# EAGLE design Super_Dolly_Board (EAGLE 6.2)
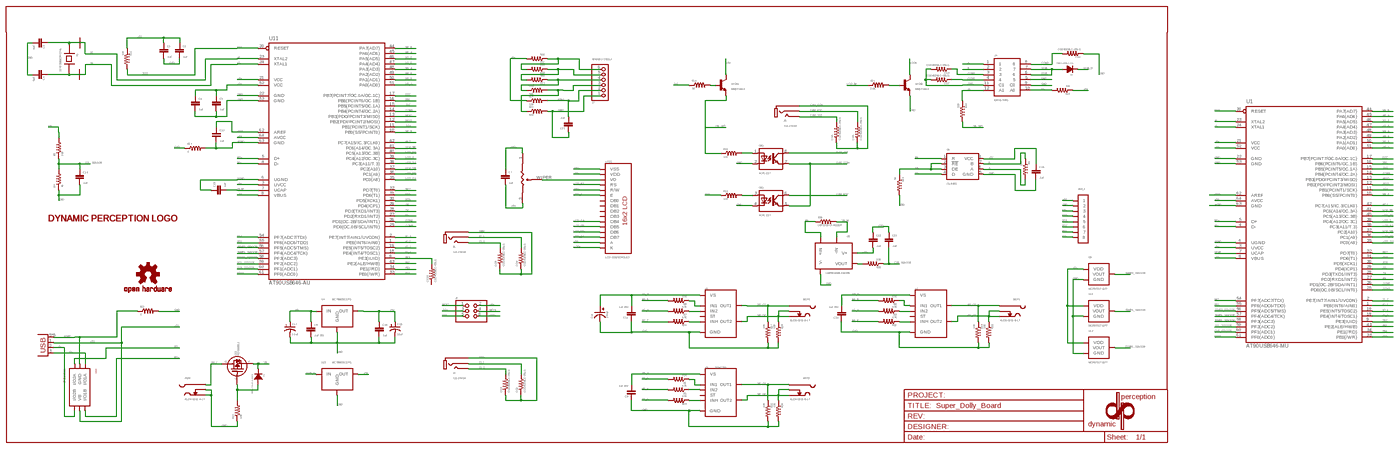
[diagram p0: schematic, sheet 1, overview]
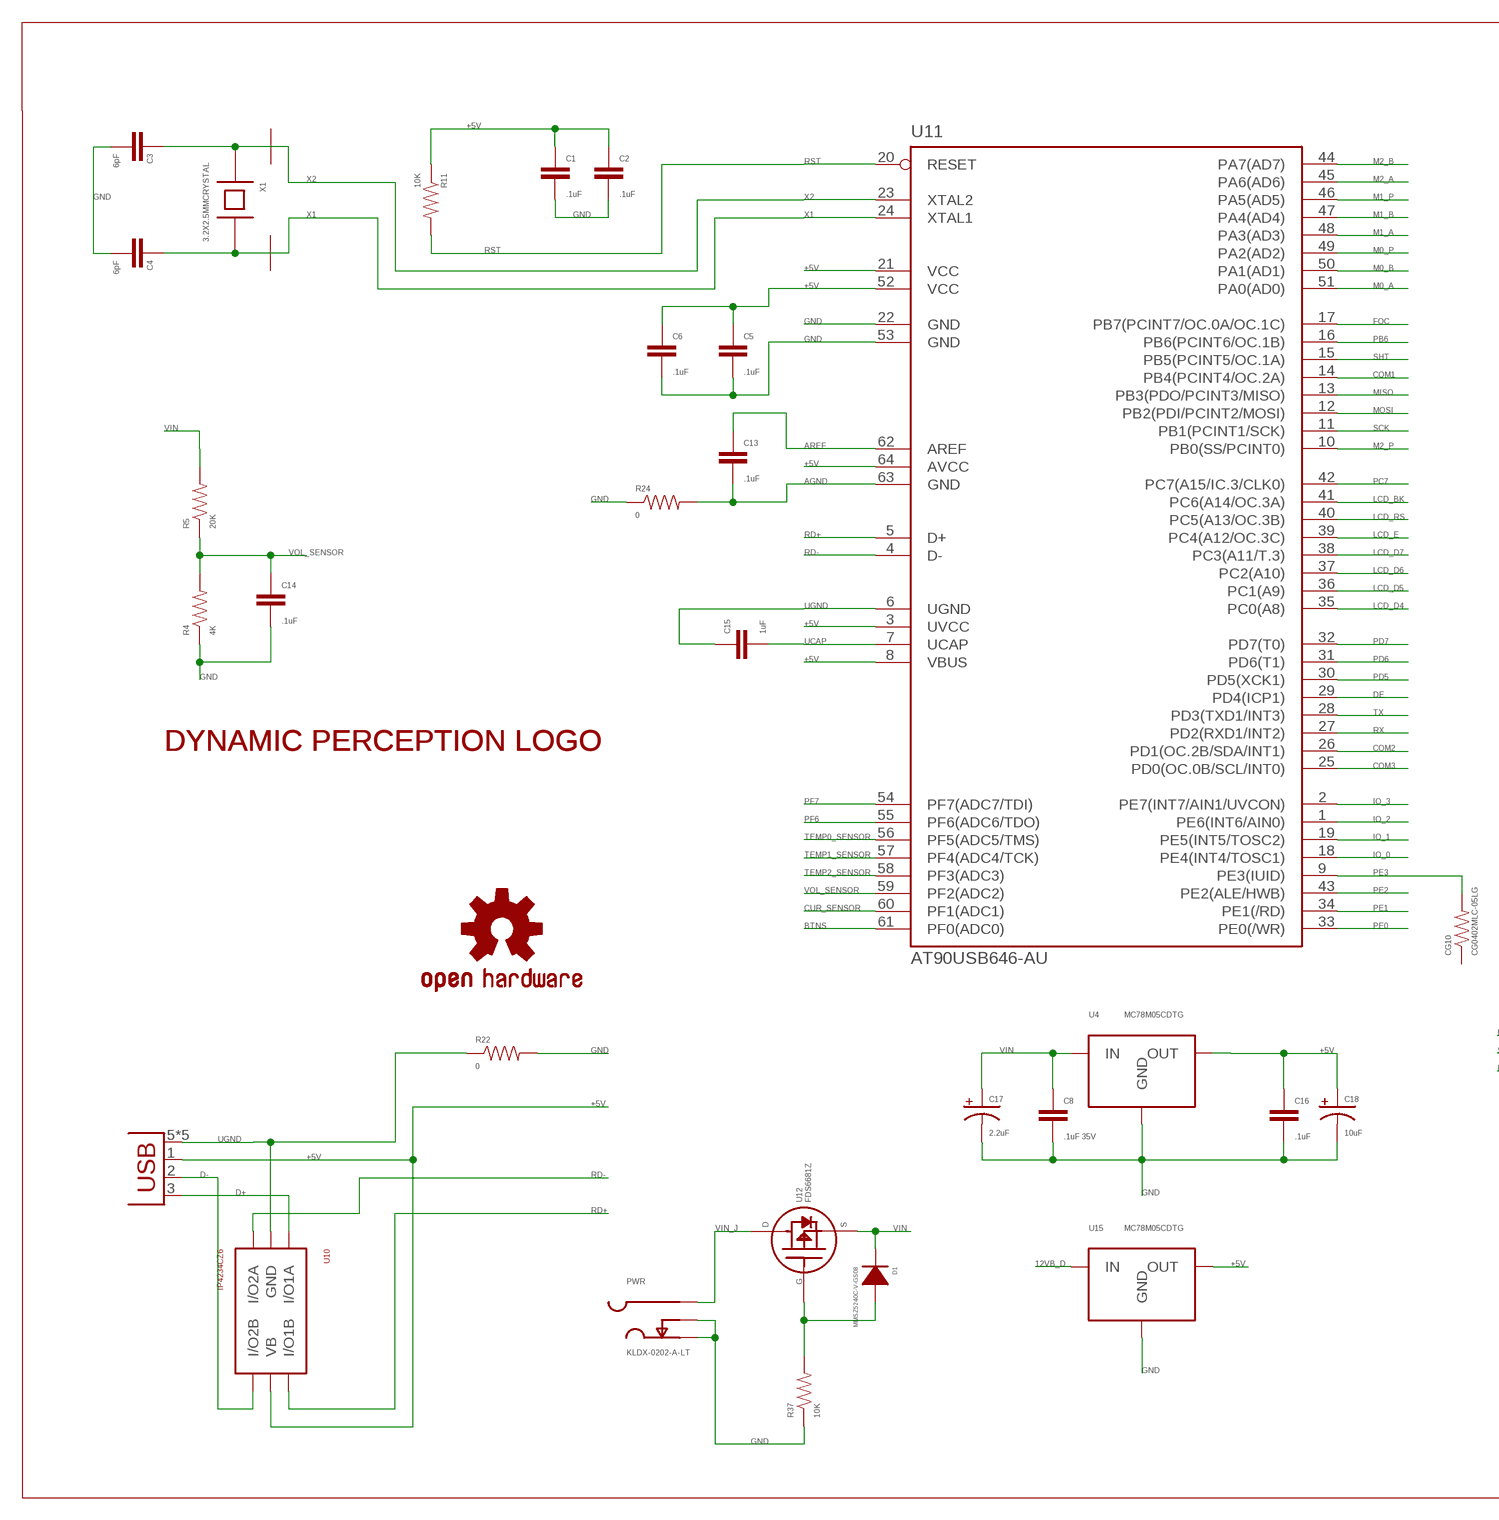
[diagram p1: schematic, sheet 1, part 1 of 4]
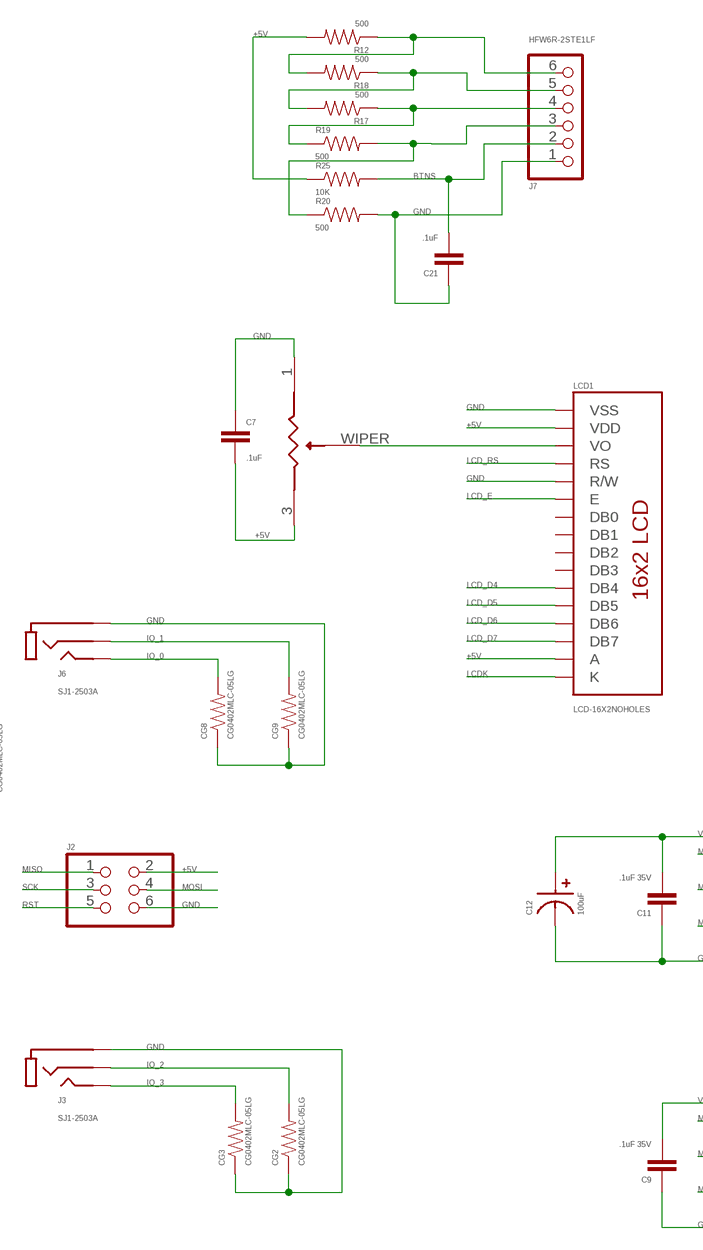
[diagram p2: schematic, sheet 1, part 2 of 4]
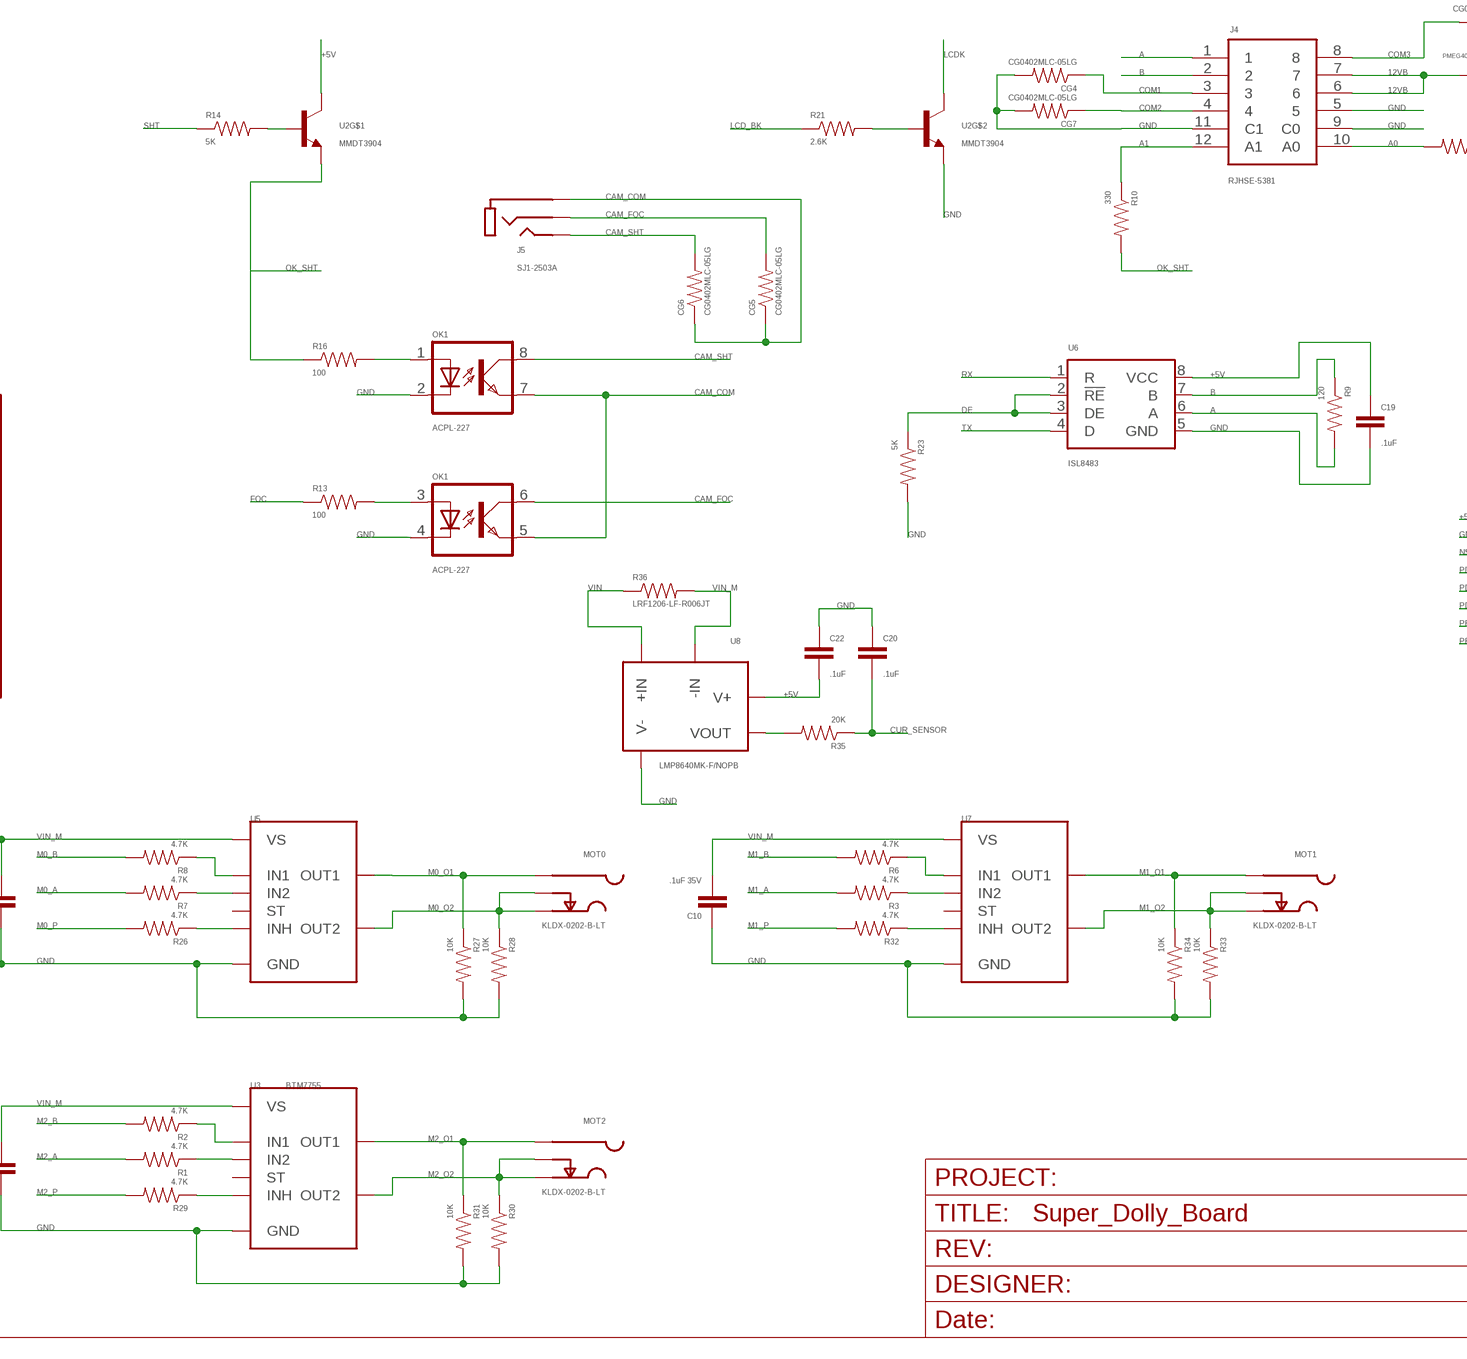
[diagram p3: schematic, sheet 1, part 3 of 4]
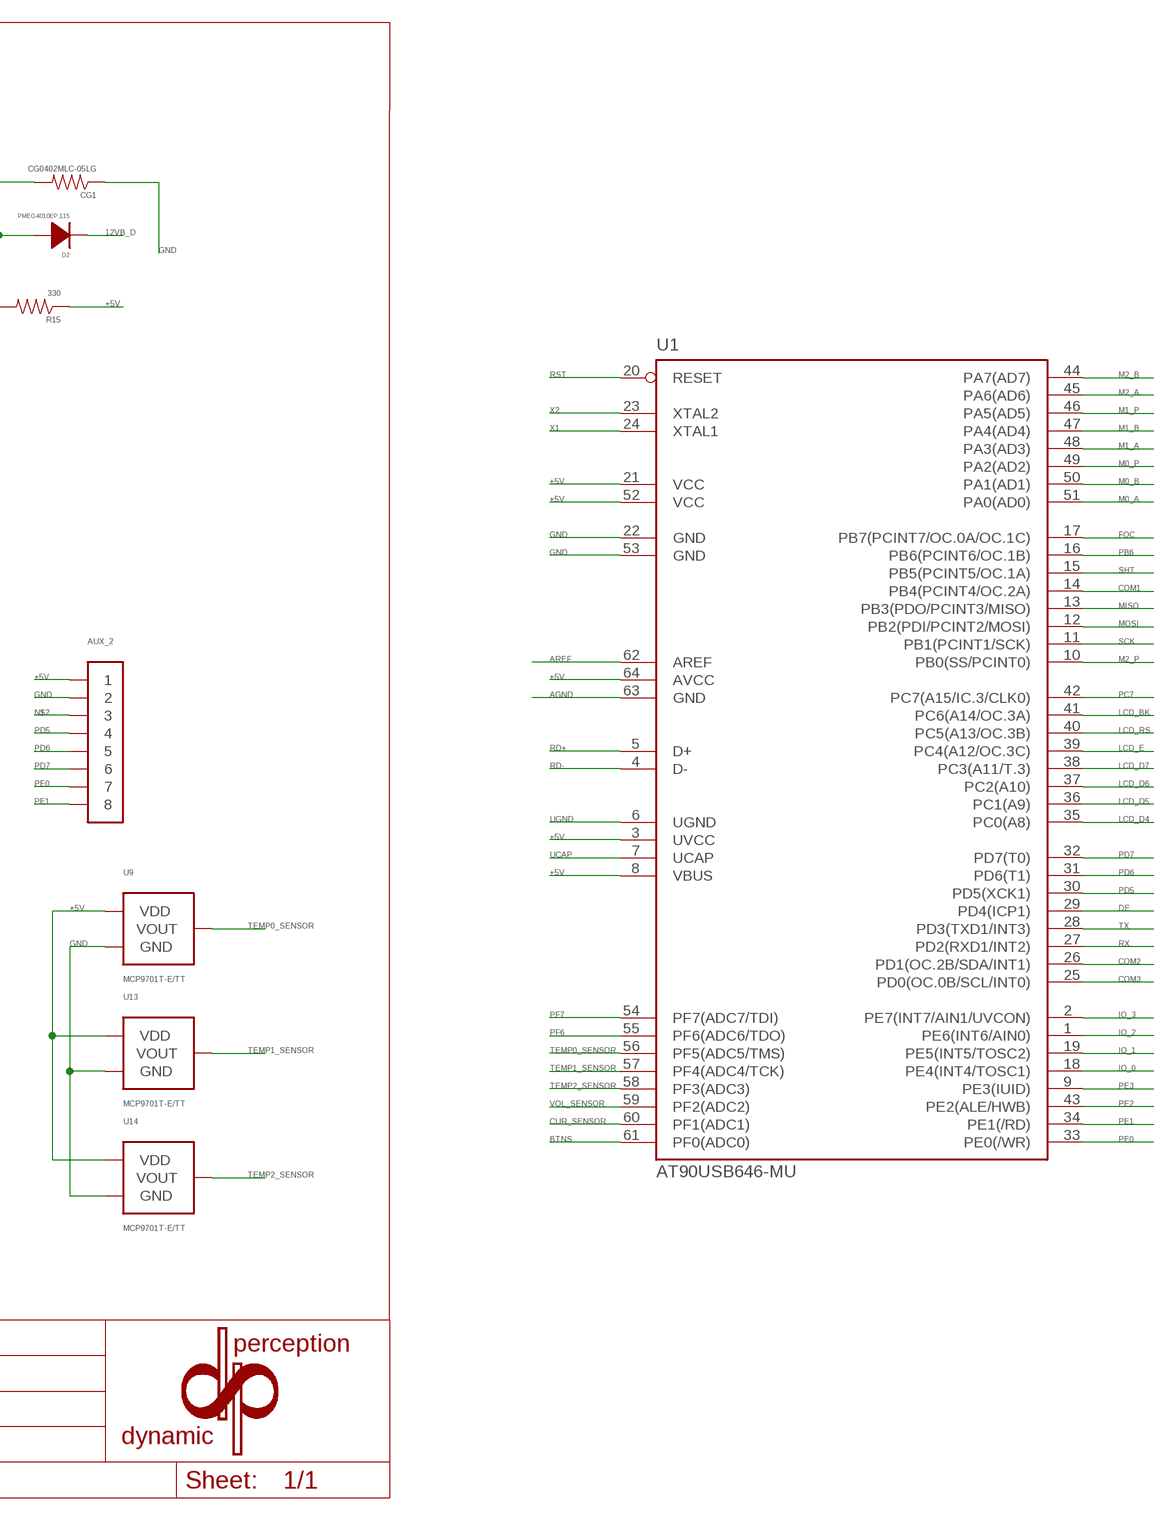
[diagram p4: schematic, sheet 1, part 4 of 4]

## Parts
AUX_2  PH_1X081.27MM_PTH  [HEADER_01X08_1.27_PTH]
C1  .1uF  CAP_NONPOL0402  [0402_CAP]
C2  .1uF  CAP_NONPOL0402  [0402_CAP]
C3  6pF  CAP0402  [C0402]
C4  6pF  CAP0402  [C0402]
C5  .1uF  CAP_NONPOL0402  [0402_CAP]
C6  .1uF  CAP_NONPOL0402  [0402_CAP]
C7  .1uF  CAP_NONPOL0402  [0402_CAP]
C8  .1uF 35V  CAP_NONPOL0402  [0402_CAP]
C9  .1uF 35V  CAP_NONPOL0402  [0402_CAP]
C10  .1uF 35V  CAP_NONPOL0402  [0402_CAP]
C11  .1uF 35V  CAP_NONPOL0402  [0402_CAP]
C12  100uF  CAPACITOR_POLARIZED6.3MM_SMD  [6.3MM_CAP_SMD]
C13  .1uF  CAP_NONPOL0402  [0402_CAP]
C14  .1uF  CAP_NONPOL0402  [0402_CAP]
C15  1uF  CAP_NONPOL0402  [0402_CAP]
C16  .1uF  CAP_NONPOL0402  [0402_CAP]
C17  2.2uF  CAP_POL1206  [EIA3216]
C18  10uF  CAP_POL1206  [EIA3216]
C19  .1uF  CAP_NONPOL0402  [0402_CAP]
C20  .1uF  CAP_NONPOL0402  [0402_CAP]
C21  .1uF  CAP_NONPOL0402  [0402_CAP]
C22  .1uF  CAP_NONPOL0402  [0402_CAP]
CG1  CG0402MLC-05LG  RESISTOR0402  [0402_RES]
CG2  CG0402MLC-05LG  RESISTOR0402  [0402_RES]
CG3  CG0402MLC-05LG  RESISTOR0402  [0402_RES]
CG4  CG0402MLC-05LG  RESISTOR0402  [0402_RES]
CG5  CG0402MLC-05LG  RESISTOR0402  [0402_RES]
CG6  CG0402MLC-05LG  RESISTOR0402  [0402_RES]
CG7  CG0402MLC-05LG  RESISTOR0402  [0402_RES]
CG8  CG0402MLC-05LG  RESISTOR0402  [0402_RES]
CG9  CG0402MLC-05LG  RESISTOR0402  [0402_RES]
CG10  CG0402MLC-05LG  RESISTOR0402  [0402_RES]
D1  MMSZ5240C-V-GS08  DIODESOD-123  [SOD-123]
D2  PMEG4010EP,115  DIODESOD-128  [SOD-128]
J1  10118193-0001LF  USB-PTH-MICROB  [-PTH-MICROB]
J2  P2X03  [P2X03]
J3  SJ1-2503A  TRS_STEREO_JACKSJ1-2503A  [SJ1-2503A]
J4  RJHSE-5381  RJHS-538X  [RIGHT_ANGLE]
J5  SJ1-2503A  TRS_STEREO_JACKSJ1-2503A  [SJ1-2503A]
J6  SJ1-2503A  TRS_STEREO_JACKSJ1-2503A  [SJ1-2503A]
J7  HFW6R-2STE1LF  PH_1X06FFC  [HFW6R-2STE1LF]
LCD1  LCD-16X2NOHOLES  [LCD-16X2_NOHOLES]
LOGO1  DP_LOGOSMALL  [DP_LOGO_SMALL]
LOGO2  DP_LOGOMICRO  [DP_LOGO_MICRO]
LOGO3  DP_LOGOSUPERDOLLYBOARDLOGO  [DP_SDB_LOGO]
MOT0  KLDX-0202-B-LT  DC_JACKPTH_TIGHT  [DC_JACK_PTH_TIGHT]
MOT1  KLDX-0202-B-LT  DC_JACKPTH_TIGHT  [DC_JACK_PTH_TIGHT]
MOT2  KLDX-0202-B-LT  DC_JACKPTH_TIGHT  [DC_JACK_PTH_TIGHT]
OK1  ACPL-227  [SOIC8]
P1  TC33X-2  [3MMSMD]
PWR  KLDX-0202-A-LT  DC_JACKPTH_TIGHT  [DC_JACK_PTH_TIGHT]
R1  4.7K  RESISTOR0402  [0402_RES]
R2  4.7K  RESISTOR0402  [0402_RES]
R3  4.7K  RESISTOR0402  [0402_RES]
R4  4K  RESISTOR0402  [0402_RES]
R5  20K  RESISTOR0402  [0402_RES]
R6  4.7K  RESISTOR0402  [0402_RES]
R7  4.7K  RESISTOR0402  [0402_RES]
R8  4.7K  RESISTOR0402  [0402_RES]
R9  120  RESISTOR0402  [0402_RES]
R10  330  RESISTOR0402  [0402_RES]
R11  10K  RESISTOR0402  [0402_RES]
R12  500  RESISTOR0402  [0402_RES]
R13  100  RESISTOR0402  [0402_RES]
R14  5K  RESISTOR0402  [0402_RES]
R15  330  RESISTOR0402  [0402_RES]
R16  100  RESISTOR0402  [0402_RES]
R17  500  RESISTOR0402  [0402_RES]
R18  500  RESISTOR0402  [0402_RES]
R19  500  RESISTOR0402  [0402_RES]
R20  500  RESISTOR0402  [0402_RES]
R21  2.6K  RESISTOR0402  [0402_RES]
R22  0  RESISTOR0402  [0402_RES]
R23  5K  RESISTOR0402  [0402_RES]
R24  0  RESISTOR0402  [0402_RES]
R25  10K  RESISTOR0402  [0402_RES]
R26  4.7K  RESISTOR0402  [0402_RES]
R27  10K  RESISTOR0805  [0805]
R28  10K  RESISTOR0805  [0805]
R29  4.7K  RESISTOR0402  [0402_RES]
R30  10K  RESISTOR0805  [0805]
R31  10K  RESISTOR0805  [0805]
R32  4.7K  RESISTOR0402  [0402_RES]
R33  10K  RESISTOR0805  [0805]
R34  10K  RESISTOR0805  [0805]
R35  20K  RESISTOR0402  [0402_RES]
R36  LRF1206-LF-R006JT  RESISTOR1206  [1206]
R37  10K  RESISTOR0402  [0402_RES]
U1  AT90USB646-MU  AT90USB647-MU  [MLF64]
U2  MMDT3904  [SOT363]
U3  BTM7755  BTM7755PG-DSO-36-29  [PG-DSO-36-29]
U4  MC78M05CDTG  FIXED_VOLTAGE_REGDPAK-3  [DPAK-3]
U5  BTM7755PG-DSO-36-29  [PG-DSO-36-29]
U6  ISL8483  SN65176D  [SO-08]
U7  BTM7755PG-DSO-36-29  [PG-DSO-36-29]
U8  LMP8640MK-F/NOPB  LMP8640TSOT-6  [TSOT-6]
U9  MCP9701T-E/TT  MCP970XSOT-23-3  [SOT-23-3]
U10  IP4234CZ6  IP4234CZ6SOT-457  [SOT-457]
U11  AT90USB646-AU  AT90USB647-AU  [TQFP64]
U12  FDS6681Z  MOSFET_P-CHANNEL_SINGLEP3-POWER  [DSO-8]
U13  MCP9701T-E/TT  MCP970XSOT-23-3  [SOT-23-3]
U14  MCP9701T-E/TT  MCP970XSOT-23-3  [SOT-23-3]
U15  MC78M05CDTG  FIXED_VOLTAGE_REGDPAK-3  [DPAK-3]
U$1  DP_FRAME  [DP_FRAME]
U$2  OSHW-LOGOS  [OSHW-LOGO-S]
X1  3.2X2.5MMCRYSTAL  [3.2X2.5MM]

## Nets
12VB: D2.ANODE J4.6 J4.7
12VB_D [power]: D2.CATHODE U15.1(IN)
+5V [usbvcc]: AUX_2.P$1 C1.1 C2.1 C5.1 C6.1 C7.2 C16.1 C18.A(+) C19.1 C22.2 J1.1(VBUS) J2.2 LCD1.2(VDD) LCD1.15(A) P1.3 R11.1 R12.2 R15.1 R25.1 U1.3(UVCC) U1.8(VBUS) U1.21(VCC) U1.52(VCC) U1.64(AVCC) U2.3(C) U4.2(OUT) U6.8(VCC) U8.6(V+) U9.1(VDD) U10.5(VB) U11.3(UVCC) U11.8(VBUS) U11.21(VCC) U11.52(VCC) U11.64(AVCC) U13.1(VDD) U14.1(VDD) U15.2(OUT)
A: J4.1 R9.2 U6.6(A)
A0: J4.10(A0) R15.2
A1: J4.12(A1) R10.1
AGND: C13.2 R24.2 U1.63(GND) U11.63(GND)
AREF [aref]: C13.1 U1.62(AREF) U11.62(AREF)
B: J4.2 R9.1 U6.7(B)
BTNS: C21.2 J7.2 R25.2 U1.61(PF0(ADC0)) U11.61(PF0(ADC0))
CAM_COM: CG5.1 CG6.1 J5.1(S) OK1.5(EMIT1) OK1.7(EMIT)
CAM_FOC: CG5.2 J5.4(R) OK1.6(COL1)
CAM_SHT: CG6.2 J5.2(T) J5.3(T) OK1.8(COL)
COM1: CG4.1 J4.3 U1.14(PB4(PCINT4/OC.2A)) U11.14(PB4(PCINT4/OC.2A))
COM2: CG7.1 J4.4 U1.26(PD1(OC.2B/SDA/INT1)) U11.26(PD1(OC.2B/SDA/INT1))
COM3: CG1.2 J4.8 U1.25(PD0(OC.0B/SCL/INT0)) U11.25(PD0(OC.0B/SCL/INT0))
CUR_SENSOR: C20.2 R35.1 U1.60(PF1(ADC1)) U11.60(PF1(ADC1))
D+: J1.3(D+) U10.1(I/O1A)
D-: J1.2(D-) U10.6(I/O2B)
DE: R23.1 U1.29(PD4(ICP1)) U6.2(!RE) U6.3(DE) U11.29(PD4(ICP1))
FOC: R13.1 U1.17(PB7(PCINT7/OC.0A/OC.1C)) U11.17(PB7(PCINT7/OC.0A/OC.1C))
GND: AUX_2.P$2 C1.2 C2.2 C3.1 C4.1 C5.2 C6.2 C7.1 C8.2 C9.1 C10.1 C11.1 C12.NEG C14.2 C16.2 C17.C(-) C18.C(-) C19.2 C20.1 C21.1 C22.1 CG1.1 CG2.1 CG3.1 CG4.2 CG7.2 CG8.1 CG9.1 J2.6 J3.1(S) J4.5 J4.9(C0) J4.11(C1) J6.1(S) J7.1 LCD1.1(VSS) LCD1.5(R/W) OK1.2(C) OK1.4(C1) P1.1 PWR.GND(SLEEVE) PWR.GNDBREAK(SLEEVE_SHUNT) R4.1 R20.2 R22.2 R23.2 R24.1 R27.2 R28.2 R30.2 R31.2 R33.2 R34.2 R37.1 U1.22(GND) U1.53(GND) U2.1(E) U3.5(GND) U3.6(GND) U3.7(GND) U3.8(GND) U3.23(GND) U3.24(GND) U3.25(GND) U3.26(GND) U4.4(GND) U5.5(GND) U5.6(GND) U5.7(GND) U5.8(GND) U5.23(GND) U5.24(GND) U5.25(GND) U5.26(GND) U6.5(GND) U7.5(GND) U7.6(GND) U7.7(GND) U7.8(GND) U7.23(GND) U7.24(GND) U7.25(GND) U7.26(GND) U8.2(V-) U9.3(GND) U11.22(GND) U11.53(GND) U13.3(GND) U14.3(GND) U15.4(GND)
IO_0: CG8.2 J6.2(T) J6.3(T) U1.18(PE4(INT4/TOSC1)) U11.18(PE4(INT4/TOSC1))
IO_1: CG9.2 J6.4(R) U1.19(PE5(INT5/TOSC2)) U11.19(PE5(INT5/TOSC2))
IO_2: CG2.2 J3.4(R) U1.1(PE6(INT6/AIN0)) U11.1(PE6(INT6/AIN0))
IO_3: CG3.2 J3.2(T) J3.3(T) U1.2(PE7(INT7/AIN1/UVCON)) U11.2(PE7(INT7/AIN1/UVCON))
LCD_BK: R21.1 U1.41(PC6(A14/OC.3A)) U11.41(PC6(A14/OC.3A))
LCD_D4: LCD1.11(DB4) U1.35(PC0(A8)) U11.35(PC0(A8))
LCD_D5: LCD1.12(DB5) U1.36(PC1(A9)) U11.36(PC1(A9))
LCD_D6: LCD1.13(DB6) U1.37(PC2(A10)) U11.37(PC2(A10))
LCD_D7: LCD1.14(DB7) U1.38(PC3(A11/T.3)) U11.38(PC3(A11/T.3))
LCD_E: LCD1.6(E) U1.39(PC4(A12/OC.3C)) U11.39(PC4(A12/OC.3C))
LCD_RS: LCD1.4(RS) U1.40(PC5(A13/OC.3B)) U11.40(PC5(A13/OC.3B))
LCDK: LCD1.16(K) U2.6(C)
M0_A: R7.2 U1.51(PA0(AD0)) U11.51(PA0(AD0))
M0_A1: R7.1 U5.10(IN2)
M0_B: R8.2 U1.50(PA1(AD1)) U11.50(PA1(AD1))
M0_B1: R8.1 U5.9(IN1)
M0_O1: MOT0.PWR(PIN) R27.1 U5.1(OUT1) U5.2(OUT1) U5.3(OUT1) U5.4(OUT1) U5.33(OUT1) U5.34(OUT1) U5.35(OUT1) U5.36(OUT1)
M0_O2: MOT0.GND(SLEEVE) MOT0.GNDBREAK(SLEEVE_SHUNT) R28.1 U5.15(OUT2) U5.16(OUT2) U5.17(OUT2) U5.18(OUT2) U5.19(OUT2) U5.20(OUT2) U5.21(OUT2) U5.22(OUT2)
M0_P: R26.2 U1.49(PA2(AD2)) U11.49(PA2(AD2))
M0_P1: R26.1 U5.27(INH)
M1_A: R3.2 U1.48(PA3(AD3)) U11.48(PA3(AD3))
M1_B: R6.2 U1.47(PA4(AD4)) U11.47(PA4(AD4))
M1_O1: MOT1.PWR(PIN) R34.1 U7.1(OUT1) U7.2(OUT1) U7.3(OUT1) U7.4(OUT1) U7.33(OUT1) U7.34(OUT1) U7.35(OUT1) U7.36(OUT1)
M1_O2: MOT1.GND(SLEEVE) MOT1.GNDBREAK(SLEEVE_SHUNT) R33.1 U7.15(OUT2) U7.16(OUT2) U7.17(OUT2) U7.18(OUT2) U7.19(OUT2) U7.20(OUT2) U7.21(OUT2) U7.22(OUT2)
M1_P: R32.2 U1.46(PA5(AD5)) U11.46(PA5(AD5))
M2_A: R1.2 U1.45(PA6(AD6)) U11.45(PA6(AD6))
M2_B: R2.2 U1.44(PA7(AD7)) U11.44(PA7(AD7))
M2_O1: MOT2.PWR(PIN) R31.1 U3.1(OUT1) U3.2(OUT1) U3.3(OUT1) U3.4(OUT1) U3.33(OUT1) U3.34(OUT1) U3.35(OUT1) U3.36(OUT1)
M2_O2: MOT2.GND(SLEEVE) MOT2.GNDBREAK(SLEEVE_SHUNT) R30.1 U3.15(OUT2) U3.16(OUT2) U3.17(OUT2) U3.18(OUT2) U3.19(OUT2) U3.20(OUT2) U3.21(OUT2) U3.22(OUT2)
M2_P: R29.2 U1.10(PB0(SS/PCINT0)) U11.10(PB0(SS/PCINT0))
MISO: J2.1 U1.13(PB3(PDO/PCINT3/MISO)) U11.13(PB3(PDO/PCINT3/MISO))
MOSI: J2.4 U1.12(PB2(PDI/PCINT2/MOSI)) U11.12(PB2(PDI/PCINT2/MOSI))
N$1: R35.2 U8.1(VOUT)
N$2: AUX_2.P$3
N$3: D1.ANODE R37.2 U12.4(GATE)
N$4: R3.1 U7.10(IN2)
N$5: R21.2 U2.2(B)
N$6: R6.1 U7.9(IN1)
N$7: R32.1 U7.27(INH)
N$8: R29.1 U3.27(INH)
N$9: R2.1 U3.9(IN1)
N$10: R1.1 U3.10(IN2)
N$21: LCD1.3(VO) P1.WIPER
N$22: OK1.3(A1) R13.2
N$23: OK1.1(A) R16.2
N$25: R14.2 U2.5(B)
N$27: J7.6 R12.1 R18.2
N$28: J7.4 R17.1 R19.1
N$29: J7.5 R17.2 R18.1
N$30: J7.3 R19.2 R20.1
OK_SHT: R10.2 R16.1 U2.4(E)
PB6: U1.16(PB6(PCINT6/OC.1B)) U11.16(PB6(PCINT6/OC.1B))
PC7: U1.42(PC7(A15/IC.3/CLK0)) U11.42(PC7(A15/IC.3/CLK0))
PD5: AUX_2.P$4 U1.30(PD5(XCK1)) U11.30(PD5(XCK1))
PD6: AUX_2.P$5 U1.31(PD6(T1)) U11.31(PD6(T1))
PD7: AUX_2.P$6 U1.32(PD7(T0)) U11.32(PD7(T0))
PE0: AUX_2.P$7 U1.33(PE0(/WR)) U11.33(PE0(/WR))
PE1: AUX_2.P$8 U1.34(PE1(/RD)) U11.34(PE1(/RD))
PE2: U1.43(PE2(ALE/HWB)) U11.43(PE2(ALE/HWB))
PE3: CG10.2 U1.9(PE3(IUID)) U11.9(PE3(IUID))
PF6: U1.55(PF6(ADC6/TDO)) U11.55(PF6(ADC6/TDO))
PF7: U1.54(PF7(ADC7/TDI)) U11.54(PF7(ADC7/TDI))
RD+: U1.5(D+) U10.3(I/O1B) U11.5(D+)
RD-: U1.4(D-) U10.4(I/O2A) U11.4(D-)
RST: J2.5 R11.2 U1.20(RESET) U11.20(RESET)
RX: U1.27(PD2(RXD1/INT2)) U6.1(R) U11.27(PD2(RXD1/INT2))
SCK: J2.3 U1.11(PB1(PCINT1/SCK)) U11.11(PB1(PCINT1/SCK))
SHT: R14.1 U1.15(PB5(PCINT5/OC.1A)) U11.15(PB5(PCINT5/OC.1A))
TEMP0_SENSOR: U1.56(PF5(ADC5/TMS)) U9.2(VOUT) U11.56(PF5(ADC5/TMS))
TEMP1_SENSOR: U1.57(PF4(ADC4/TCK)) U11.57(PF4(ADC4/TCK)) U13.2(VOUT)
TEMP2_SENSOR: U1.58(PF3(ADC3)) U11.58(PF3(ADC3)) U14.2(VOUT)
TX: U1.28(PD3(TXD1/INT3)) U6.4(D) U11.28(PD3(TXD1/INT3))
UCAP: C15.2 U1.7(UCAP) U11.7(UCAP)
UGND: C15.1 J1.5(GND) J1.S1(GND) J1.S2(GND) J1.S3(GND) J1.S4(GND) R22.1 U1.6(UGND) U10.2(GND) U11.6(UGND)
VIN [power]: C8.1 C17.A(+) D1.CATHODE R5.2 R36.1 U4.1(IN) U8.3(+IN) U12.1(SOURCE) U12.2(SOURCE) U12.3(SOURCE)
VIN_J: PWR.PWR(PIN) U12.5(DRAIN) U12.6(DRAIN) U12.7(DRAIN) U12.8(DRAIN)
VIN_M [power]: C9.2 C10.2 C11.2 C12.POS R36.2 U3.11(VS) U3.12(VS) U3.13(VS) U3.14(VS) U3.29(VS) U3.30(VS) U3.31(VS) U3.32(VS) U5.11(VS) U5.12(VS) U5.13(VS) U5.14(VS) U5.29(VS) U5.30(VS) U5.31(VS) U5.32(VS) U7.11(VS) U7.12(VS) U7.13(VS) U7.14(VS) U7.29(VS) U7.30(VS) U7.31(VS) U7.32(VS) U8.4(-IN)
VOL_SENSOR: C14.1 R4.2 R5.1 U1.59(PF2(ADC2)) U11.59(PF2(ADC2))
X1: C4.2 U1.24(XTAL1) U11.24(XTAL1) X1.3
X2: C3.2 U1.23(XTAL2) U11.23(XTAL2) X1.1
Unconnected: CG10.1 LCD1.7(DB0) LCD1.8(DB1) LCD1.9(DB2) LCD1.10(DB3) U3.28(ST) U5.28(ST) U7.28(ST)

## Power pins joined to a net without a drawn wire
4: X1.4
GND: X1.2(GND)

## Library data of the parts
AUX_2 = PP_Connectors:PH_1X08
C1 C2 C5-C11 C13-C16 C19-C22 = parkers_parts:CAP_NONPOL
C3 C4 = SparkFun:CAP: Capacitor Standard 0603 ceramic capacitor, and 0.1" leaded capacitor.
C12 = PP_Passives:CAPACITOR_POLARIZED: Polarized capacitors
C17 C18 = SparkFun:CAP_POL: Capacitor Polarized These are standard SMD and PTH capacitors. Normally 10uF, 47uF, and 100uF in electrolytic and tantalum varieties. Always verify the external diameter of the through hole cap, it varies with capacity, voltage, and manufacturer. The EIA devices should be standard.
CG1-CG10 R1-R26 R29 R32 R35 R37 = parkers_parts:RESISTOR
D1 D2 = parkers_parts:DIODE
J1 = SparkFun-Connectors:USB: USB Connectors USB-B-PTH is fully proven SKU : PRT-00139 USB-miniB is fully proven SKU : PRT-00587 USB-A-PCB is untested. USB-A-H is throughly reviewed, but untested. Spark Fun Electronics SKU : PRT-00437 USB-B-SMT is throughly reviewed, but untested. Needs silkscreen touching up. USB-A-S has not been used/tested USB-MB-H has not been used/tested
J2 = parkers_parts:P2X03
J3 J5 J6 = parkers_parts:TRS_STEREO_JACK
J4 = amphenol ethernet:RJHS-538X: RJHS-538X series right-angle ethernet (RJ45) connector with two LEDs
J7 = PP_Connectors:PH_1X06: 6 pin connectors
LCD1 = SparkFun-Displays:LCD-16X2: Standard text-only 16x2 parallel input LCD
LOGO1-LOGO3 = parkers_parts:DP_LOGO
MOT0 MOT1 MOT2 PWR = PP_Connectors:DC_JACK: DC JACK
OK1 = avago-opto:ACPL-227: ACPL-227 Dual optocoupler SOIC8
P1 = bourns trimpot:TC33X-2: Bourns TC33X-2 SMD Trimmer Potentiometer
R27 R28 R30 R31 R33 R34 R36 = PP_Passives:RESISTOR: Resistors
U1 U11 = at90usb:AT90USB647-*: Atmel AT90USB647 AVR Microcontroller with USB Interface and 64kB Flash Memory
U2 = SparkFun-DiscreteSemi:MMDT3904: Dual NPN transistor
U3 U5 U7 = PP_PowerIC:BTM7755: Manufacturer Part #: BTM7755 Manufacturer: Infineon Technologies Description: Motor / Motion / Ignition Controllers & Drivers Hi Current H-Bridge Trilith IC 3G
U4 U15 = PP_PowerIC:FIXED_VOLTAGE_REG
U6 = texas:SN65176: DIFFERENTIAL BUS TRANSCEIVER Source: http://focus.ti.com .. sn65176b.pdf; MF: TEXAS INSTRUMENTS; MPN: SN65176BD; OC_FARNELL: 9589970; OC_NEWARK: 08F5891
U8 = PP_AnalogIC:LMP8640
U9 U13 U14 = PP_Sensors:MCP970X
U10 = parkers_parts:IP4234CZ6: Mouser Part #: 771-IP4234CZ6125 Manufacturer Part #: IP4234CZ6,125 Manufacturer: NXP Semiconductors Description: ESD Suppressors Single USB 2.0 ESD Protection 6-Pin http://www.mouser.com/ProductDetail/NXP-Semiconductors/IP4234CZ6125/?qs=sGAEpiMZZMvxHShE6Whpu7QUdHOfUl1T0xbl582qhFk%3d
U12 = PP_DiscreteSemi:MOSFET_P-CHANNEL_SINGLE
U$1 = parkers_parts:DP_FRAME; DNAME: Parker Dillmann; PNAME: MX-2+1; REVNUM: 5
U$2 = SparkFun-Aesthetics:OSHW-LOGO: Open Source Hardware Logo This logo indicates the piece of hardware it is found on incorporates a OSHW license and/or adheres to the definition of open source hardware found here: http://freedomdefined.org/OSHW
X1 = kyocera-crystals:3.2X2.5MMCRYSTAL: Kyocera 3.2x2.5 Mobile Crystal

## Net classes
1 power: width 0.254 mm, drill 0.61 mm, clearance 0.254 mm
2 gnd: width 0.254 mm, drill 0.61 mm, clearance 0.254 mm
3 usbvcc: width 0.254 mm, drill 0.61 mm, clearance 0.254 mm
4 aref: width 0.254 mm, drill 0.61 mm, clearance 0.254 mm

## Board
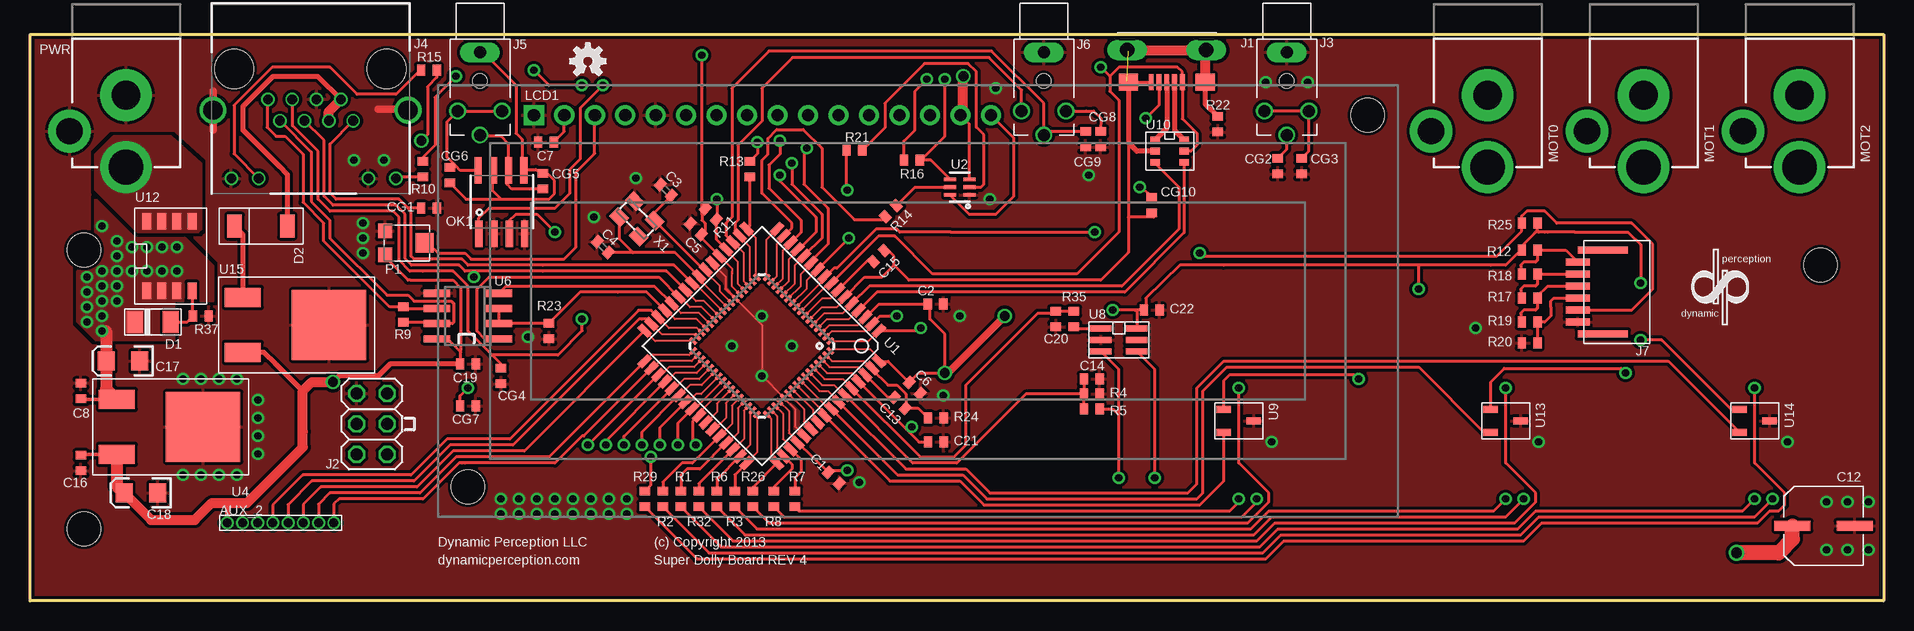
[diagram p5: board, top side]
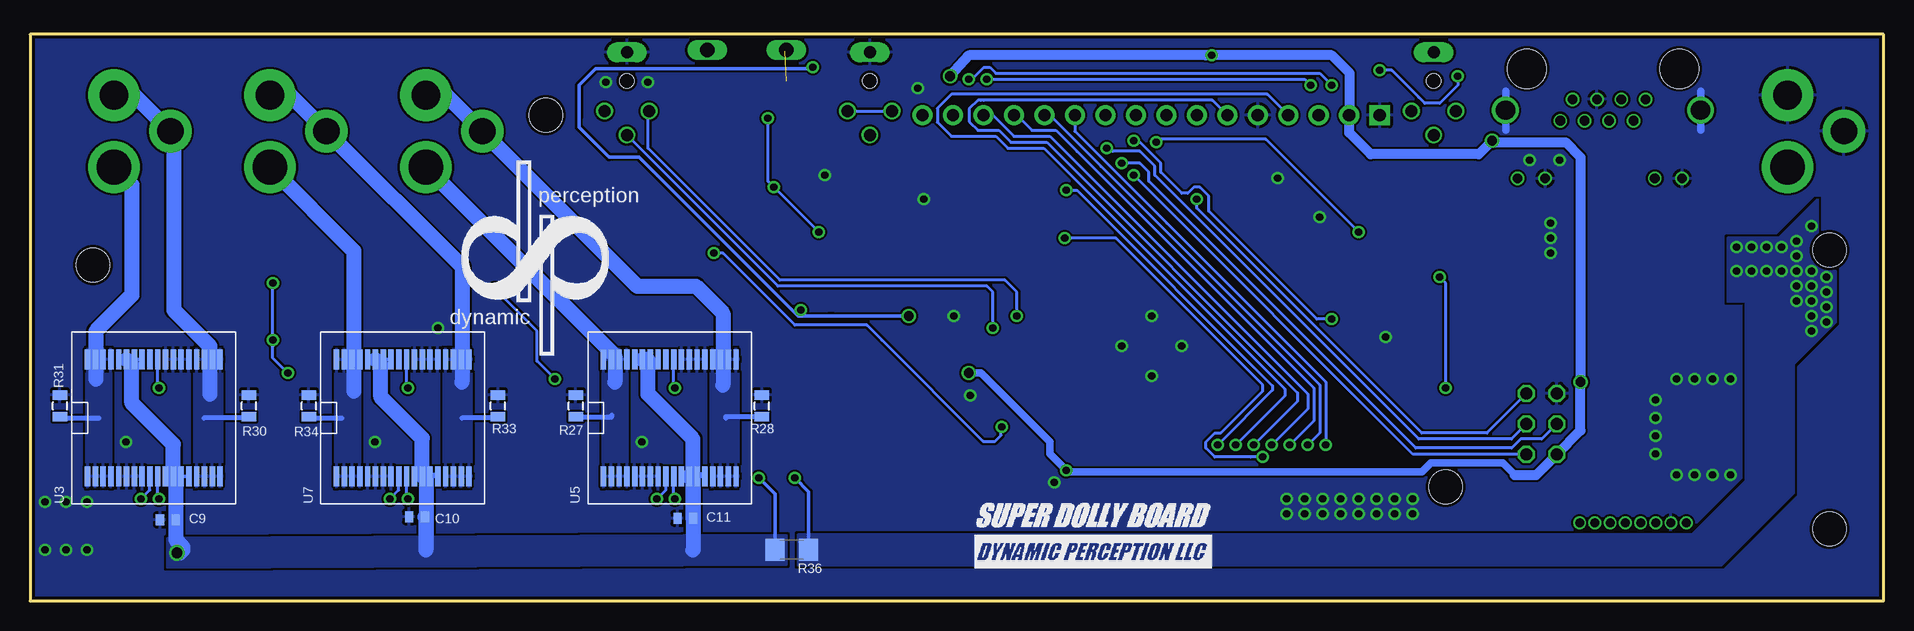
[diagram p6: board, bottom side, seen from below]

Size 154.5 x 47.25 mm. Coordinates in mm from the lower left corner, seen from the top.
Outline: 154.5,47.25 154.5,0 0,0 0,47.25 154.5,47.25
Copper layers (1*16): Top 0.035mm / dielectric 1.5mm / Bottom 0.035mm
Design rules: minimum track width 7mil, minimum drill 8mil, track to track 7mil, track to pad 7mil, pad to pad 7mil, via to via 7mil, smd to smd 7mil, copper to edge 10mil, drill to drill 8mil, minimum pad ring 1mil, minimum via ring 8mil, stop-mask expansion 4mil, vias tented up to drill 25mil, thermal gap 10mil
Holes 2.8 mm at 111.5,40.5 36.5,9.5 4.5,29.25 4.5,6 149.25,28

### Footprints (pad centres in the part's own frame; a part is rotated, then mirrored left to right if it is on the bottom)
HEADER_01X08_1.27_PTH = drill 0.75 pad 1.016: P$1 -3.81,0; P$2 -2.54,0; P$3 -1.27,0; P$4 0,0; P$5 1.27,0; P$6 2.54,0; P$7 3.81,0; P$8 5.08,0
0402_CAP = smd 0.7 x 0.9: 1 -0.65,0; 2 0.65,0
C0402 = smd 0.7 x 0.9: 1 -0.65,0; 2 0.65,0
6.3MM_CAP_SMD = smd 0.8 x 3: NEG 0,-2.6; POS 0,2.6
EIA3216 = smd 1.4 x 1.6: A 1.4,0; C -1.4,0
0402_RES = smd 0.7 x 0.9: 1 -0.65,0; 2 0.65,0
SOD-123 = smd 1.3 x 1.8: ANODE 1.73,0; CATHODE -1.27,0
SOD-128 = smd 1.2 x 1.9: ANODE 2.2,0; CATHODE -2.2,0
-PTH-MICROB = smd 0.4 x 1.35: 1 -1.3,0; 2 -0.65,0; 3 0,0; 4 0.65,0; 5 1.3,0 | drill 1.2 long: S1 -3.3,-2.675; S2 3.3,-2.675 | smd 1.6 x 1.4: S3 -3.2,0; S4 3.2,0
P2X03 = drill 1.016 octagon: 1 -2.54,-1.27; 2 -2.54,1.27; 3 0,-1.27; 4 0,1.27; 5 2.54,-1.27; 6 2.54,1.27
SJ1-2503A = drill 1 pad 1.676 long: 1 0,0 | drill 1: 2 4.9,-1.85; 3 4.9,1.85; 4 6.9,0 | hole 1.2: 2.4,0
RIGHT_ANGLE = drill 0.8: 1 9.906,2.54; 2 8.89,4.32; 3 7.874,2.54; 4 6.858,4.32; 5 5.842,2.54; 6 4.826,4.32; 7 3.81,2.54; 8 2.794,4.32; 9 12.954,9.14; 10 10.668,9.14; 11 1.524,9.14; 12 -0.762,9.14 | drill 1.6: P$1 -1.778,3.43; P$2 14.478,3.43 | hole 3.251: 0,0; 12.7,0
HFW6R-2STE1LF = smd 0.6 x 2: 1 -2.5,0; 2 -1.5,0; 3 -0.5,0; 4 0.5,0; 5 1.5,0; 6 2.5,0 | smd 0.6 x 4.2: PAD0 -3.5,-2.1; PAD1 3.5,-2.1
LCD-16X2_NOHOLES = drill 1.016 pad 1.676 square: 1 -32,15.5 | drill 1.016 pad 1.676: 2 -29.46,15.5; 3 -26.92,15.5; 4 -24.38,15.5; 5 -21.84,15.5; 6 -19.3,15.5; 7 -16.76,15.5; 8 -14.22,15.5; 9 -11.68,15.5; 10 -9.14,15.5; 11 -6.6,15.5; 12 -4.06,15.5; 13 -1.52,15.5; 14 1.02,15.5; 15 3.56,15.5; 16 6.1,15.5
DC_JACK_PTH_TIGHT = drill 2.4 pad 4.318: GND 0,0.08 | drill 2.2 pad 3.556: GNDBREAK 4.7,3.08 | drill 2.9 pad 4.318: PWR 0,6.08
SOIC8 = smd 2.2 x 0.6: 1 0,3.81; 2 0,2.54; 3 0,1.27; 4 0,0; 5 5.28,0.05; 6 5.28,1.32; 7 5.28,2.59; 8 5.28,3.86
3MMSMD = smd 1.2 x 1.2: 1 -0.6,0.6; 3 1.4,0.6 | smd 1.6 x 1.5: WIPER 0.4,3.9
0805 = smd 0.8 x 1.2: 1 -0.9,0; 2 0.9,0
1206 = smd 1.6 x 1.8: 1 -1.4,0; 2 1.4,0
MLF64 = smd 0.7 x 0.3: 1 -4.325,3.75; 2 -4.325,3.25; 3 -4.325,2.75; 4 -4.325,2.25; 5 -4.325,1.75; 6 -4.325,1.25; 7 -4.325,0.75; 8 -4.325,0.25; 9 -4.325,-0.25; 10 -4.325,-0.75; 11 -4.325,-1.25; 12 -4.325,-1.75; 13 -4.325,-2.25; 14 -4.325,-2.75; 15 -4.325,-3.25; 16 -4.325,-3.75; 33 4.325,-3.75; 34 4.325,-3.25; 35 4.325,-2.75; 36 4.325,-2.25; 37 4.325,-1.75; 38 4.325,-1.25; 39 4.325,-0.75; 40 4.325,-0.25; 41 4.325,0.25; 42 4.325,0.75; 43 4.325,1.25; 44 4.325,1.75; 45 4.325,2.25; 46 4.325,2.75; 47 4.325,3.25; 48 4.325,3.75 | smd 0.3 x 0.7: 17 -3.75,-4.325; 18 -3.25,-4.325; 19 -2.75,-4.325; 20 -2.25,-4.325; 21 -1.75,-4.325; 22 -1.25,-4.325; 23 -0.75,-4.325; 24 -0.25,-4.325; 25 0.25,-4.325; 26 0.75,-4.325; 27 1.25,-4.325; 28 1.75,-4.325; 29 2.25,-4.325; 30 2.75,-4.325; 31 3.25,-4.325; 32 3.75,-4.325; 49 3.75,4.325; 50 3.25,4.325; 51 2.75,4.325; 52 2.25,4.325; 53 1.75,4.325; 54 1.25,4.325; 55 0.75,4.325; 56 0.25,4.325; 57 -0.25,4.325; 58 -0.75,4.325; 59 -1.25,4.325; 60 -1.75,4.325; 61 -2.25,4.325; 62 -2.75,4.325; 63 -3.25,4.325; 64 -3.75,4.325
SOT363 = smd 0.3 x 0.99: 1 -0.65,-0.8; 2 0,-0.8; 3 0.65,-0.8; 4 0.65,0.81; 5 0,0.81; 6 -0.65,0.81
PG-DSO-36-29 = smd 1.67 x 0.45: 1 -4.865,5.2; 2 -4.865,4.55; 3 -4.865,3.9; 4 -4.865,3.25; 5 -4.865,2.6; 6 -4.865,1.95; 7 -4.865,1.3; 8 -4.865,0.65; 9 -4.865,0; 10 -4.865,-0.65; 11 -4.865,-1.3; 12 -4.865,-1.95; 13 -4.865,-2.6; 14 -4.865,-3.25; 15 -4.865,-3.9; 16 -4.865,-4.55; 17 -4.865,-5.2; 18 -4.865,-5.85; 19 4.865,-5.85; 20 4.865,-5.2; 21 4.865,-4.55; 22 4.865,-3.9; 23 4.865,-3.25; 24 4.865,-2.6; 25 4.865,-1.95; 26 4.865,-1.3; 27 4.865,-0.65; 28 4.865,0; 29 4.865,0.65; 30 4.865,1.3; 31 4.865,1.95; 32 4.865,2.6; 33 4.865,3.25; 34 4.865,3.9; 35 4.865,4.55; 36 4.865,5.2
DPAK-3 = smd 3 x 1.6: 1 0,-2.285; 2 0,2.285 | smd 6.2 x 5.8: 4 -7.18,0
SO-08 = smd 0.6 x 2.2: 1 -1.905,-2.6; 2 -0.635,-2.6; 3 0.635,-2.6; 4 1.905,-2.6; 5 1.905,2.6; 6 0.635,2.6; 7 -0.635,2.6; 8 -1.905,2.6
TSOT-6 = smd 0.5 x 1.8: 1 -0.95,-1.5; 2 0,-1.5; 3 0.95,-1.5; 4 0.95,1.5; 5 0,1.5; 6 -0.95,1.5
SOT-23-3 = smd 0.6 x 1.2: 1 -0.95,-1.25; 2 0.95,-1.25; 3 0,1.25
SOT-457 = smd 0.8 x 0.55: 1 -1.2,0.95; 2 -1.2,0; 3 -1.2,-0.95; 4 1.2,-0.95; 5 1.2,0; 6 1.2,0.95
TQFP64 = smd 1.194 x 0.559: 1 -7.8,6; 2 -7.8,5.2; 3 -7.8,4.4; 4 -7.8,3.6; 5 -7.8,2.8; 6 -7.8,2; 7 -7.8,1.2; 8 -7.8,0.4; 9 -7.8,-0.4; 10 -7.8,-1.2; 11 -7.8,-2; 12 -7.8,-2.8; 13 -7.8,-3.6; 14 -7.8,-4.4; 15 -7.8,-5.2; 16 -7.8,-6; 33 7.8,-6; 34 7.8,-5.2; 35 7.8,-4.4; 36 7.8,-3.6; 37 7.8,-2.8; 38 7.8,-2; 39 7.8,-1.2; 40 7.8,-0.4; 41 7.8,0.4; 42 7.8,1.2; 43 7.8,2; 44 7.8,2.8; 45 7.8,3.6; 46 7.8,4.4; 47 7.8,5.2; 48 7.8,6 | smd 0.559 x 1.194: 17 -6,-7.8; 18 -5.2,-7.8; 19 -4.4,-7.8; 20 -3.6,-7.8; 21 -2.8,-7.8; 22 -2,-7.8; 23 -1.2,-7.8; 24 -0.4,-7.8; 25 0.4,-7.8; 26 1.2,-7.8; 27 2,-7.8; 28 2.8,-7.8; 29 3.6,-7.8; 30 4.4,-7.8; 31 5.2,-7.8; 32 6,-7.8; 49 6,7.8; 50 5.2,7.8; 51 4.4,7.8; 52 3.6,7.8; 53 2.8,7.8; 54 2,7.8; 55 1.2,7.8; 56 0.4,7.8; 57 -0.4,7.8; 58 -1.2,7.8; 59 -2,7.8; 60 -2.8,7.8; 61 -3.6,7.8; 62 -4.4,7.8; 63 -5.2,7.8; 64 -6,7.8
DSO-8 = smd 0.75 x 1.4: 1 -2.54,-2.9; 2 -1.27,-2.9; 3 0,-2.9; 4 1.27,-2.9; 5 1.27,2.9; 6 0,2.9; 7 -1.27,2.9; 8 -2.54,2.9
3.2X2.5MM = smd 1.3 x 1.05: 1 0.635,0; 2 2.935,0.01; 3 2.935,1.875; 4 0.635,1.865

### Placement (x,y rotation side)
AUX_2  20.25,6.5 0 top
C1  67,10.25 315 top
C2  75.49,24.75 0 top
C3  53,34.25 315 top
C4  47.75,29.5 315 top
C5  55.5,31 135 top
C6  73.75,17.75 315 top
C7  43,38.25 0 top
C8  4.25,17.5 90 top
C9  143,6.75 0 bottom
C10  122.25,7 0 bottom
C11  99.88,6.88 0 bottom
C12  149.5,6.25 90 top
C13  72.5,16.5 315 top
C14  88.5,18.5 0 top
C15  70.75,28.75 225 top
C16  4.25,11.5 270 top
C17  7.75,20 180 top
C18  9.25,9 180 top
C19  36.5,19.75 0 top
C20  85.5,23.5 90 top
C21  75.5,13.25 180 top
C22  93.5,24.25 180 top
CG1  33.25,32.75 180 top
CG2  104,36.25 90 top
CG3  106,36.25 90 top
CG4  39.25,18.75 270 top
CG5  42.75,35 270 top
CG6  35,35.5 90 top
CG7  36.5,16.25 0 top
CG8  89.25,38.5 90 top
CG9  88,38.5 90 top
CG10  93.5,33 90 top
D1  10,23.25 0 top
D2  19.25,31.25 0 top
J1  94.75,43.25 180 top
J2  28.5,14.75 90 top
J3  104.75,45.75 270 top
J4  29.73,44.36 180 top
J5  37.5,45.75 270 top
J6  84.5,45.75 270 top
J7  129,25.75 90 top
LCD1  74,25 0 top
LOGO1  118.5,20.5 0 bottom
LOGO2  138.5,23 0 top
LOGO3  75.75,2.75 0 bottom
MOT0  121.5,42.25 180 top
MOT1  134.5,42.25 180 top
MOT2  147.5,42.25 180 top
OK1  41.22,30.62 90 top
P1  29,30.25 270 top
PWR  8,42.25 180 top
R1  54.25,8.5 90 top
R2  52.75,8.5 90 top
R3  58.75,8.5 90 top
R4  88.5,17.25 180 top
R5  88.5,16 0 top
R6  57.25,8.5 90 top
R7  63.75,8.5 90 top
R8  62,8.5 90 top
R9  31.13,23.87 90 top
R10  32.75,36 90 top
R11  56.75,32.25 315 top
R12  125,29.25 180 top
R13  60,36 90 top
R14  71.75,32.5 45 top
R15  33.25,44.25 180 top
R16  73.5,36.75 180 top
R17  125,25.25 180 top
R18  125,27.25 180 top
R19  125,23.25 0 top
R20  125,21.5 180 top
R21  68.72,37.56 0 top
R22  99,39.75 270 top
R23  43.25,22.5 270 top
R24  75.5,15.25 180 top
R25  125,31.5 180 top
R26  60.25,8.5 90 top
R27  109,16.25 90 bottom
R28  93.5,16.25 90 bottom
R29  51.25,8.5 90 top
R30  136.25,16.25 90 bottom
R31  152,16.25 90 bottom
R32  55.75,8.5 90 top
R33  115.5,16.25 90 bottom
R34  131.25,16.25 90 bottom
R35  87,23.5 270 top
R36  91,4.25 180 bottom
R37  14.25,23.75 180 top
U1  61,21.25 225 top
U2  77.5,34.5 90 top
U3  144.5,15.25 90 bottom
U4  7.25,14.5 180 top
U5  101.5,15.25 90 bottom
U6  36.5,23.75 90 top
U7  123.75,15.25 90 bottom
U8  90.75,21.75 270 top
U9  100.75,15 270 top
U10  95,37.5 0 top
U11  61,21.25 225 top
U12  12.25,28.75 0 top
U13  123,15 270 top
U14  143.75,15 270 top
U15  17.75,23 180 top
U$1  105.25,33.5 0 top
U$2  46.5,45 0 top
X1  52.5,31.25 135 top

### Tracks (layer width: path | path; a pad name or v marks a point on that pad's centre or on a via)
12VB
  Top 0.406: J4.7 23.99,43.75 20.25,43.75 17.75,41.25 17.75,39.25 20.75,36.25 21.45,35.55 D2.ANODE
  Top 0.813: J4.6 24.9,40.8 J4.7
12VB_D
  Top 0.406: D2.CATHODE 17.75,30.55 U15.1
+5V  (via drill 0.6, 0.8)
  Top 0.178: U1.21 58.75,25.98 58.5,26.23 58.5,27.25 | 58.5,27.25 58.5,27.5 | U1.3 66.64,23 69,23 69.63,23.63 U11.3 | U1.64 66.87,21 70,21 70.76,20.24 U11.64 | U11.52 63.97,13.28 63.5,13.75 63.25,14 63.25,14.25 63.25,15.82 U1.52 | U11.21 58.5,27.71 58.5,27.25 | 66.59,26.48 U11.8 66.59,26.48 | U1.8 66.59,26.48
  Top 0.254: U11.21 55.96,30.25 C5.1 56.25,30.54 56.25,31.5 56,31.75 56,32.25 | 69.63,23.63 70.75,24.75 C2.1 75,24.59 75,23.5 76.25,22.25 v76.25,19 74.08,19 C6.1 71.52,19.98 U11.64 | R11.1 56.29,32.54 56,32.25 | U11.52 66.5,10.75 66.54,10.79 66.54,10.87 | 66.54,10.87 C1.1 | C19.1 35.92,19.82 35.92,20.75 | 35.92,20.75 35.92,20.92 35.92,26.1 35.27,26.75 31.7,26.75 31.5,26.75 29.6,28.65 P1.3 | U6.8 34.82,21.84 35.92,20.75 | C7.2 44.54,39.14 LCD1.2 44.54,40.79 | 66.54,10.87 v68.12,10.87 v68.12,10.88 | U2.3 78.3,39.76 LCD1.15 | 56,32.25 v56,45.5 | J1.1 96.05,43.5 | 96.05,43.5 96.05,44.11 95.66,44.5 90.75,44.5 90.12,43.88 90,43.75 | 90,43.75 90,42.5 90.75,41.75 90.75,30.75 87.26,27.26 75.24,27.26 72.09,30.41 70.72,30.41 U11.8 | v89.25,44.5 90,43.75 | J1.1 96.05,43.5 | J1.1 96.05,40.2 97,39.25 97.25,39 97.25,38 96.75,37.5 U10.5 | R15.1 33.9,43.65 33.12,42.88 33.12,38.88 v32.62,38.38 | 125,30.25 125.5,30.75 125.75,30.75 126.25,30.75 126.5,30.75 128.75,30.75 133.19,30.75 134.25,29.69 v134.25,26.5 | 125,30.25 124.35,29.6 | 124.35,29.6 R12.2 | 92.1,24.25 C22.2 93,24.4 93,25.25 95.85,28 99.5,28 115.75,28 | 92.1,24.25 v90.25,24.25 | 92.1,24.25 92.25,24.25 U8.6 | 124.35,29.6 124.35,29.35 123,28 121.75,28 | 121.75,28 115.75,28 | 121.75,28 | U9.1 99.5,18.25 99.5,18.38 100,18.88 110.38,18.88 v110.75,18.5 | v115.75,26 115.75,28 | U13.1 | U13.1 121.75,18.25 122.89,19.39 132.61,19.39 v133,19 | U14.1 141.8,15.95 136,21.75 v134.25,21.75 | 125,30.25 125.65,30.9 R25.1
  Top 0.305: C16.1 4.31,12.21 U4.2
  Top 0.406: AUX_2.P$1 16.5,6.5 16.5,8.16 | U15.2 19.5,20.71 20.47,19.75 22.72,17.5 22.75,17.5 | C19.1 30,19.75 29,18.75 25.75,18.75 v25.25,18.25
  Top 0.61: v76.25,19 76.5,19 v81.25,23.75
  Top 0.813: LCD1.15 77.75,40.69 77.75,43.75 v77.81,43.75 | v25.25,18.25 23.5,18.25 22.75,17.5 22.75,14.1 22.75,12.81 18.09,8.16 16.5,8.16 15.16,8.16 13.75,6.75 10.1,6.75 C18.A
  Top 1.016: U4.2 7.25,9.6 C18.A
  Bottom 0.254: v32.62,38.38 32.5,38.25 32,38.25 | v68.12,10.88 69.5,12.25 | v56,45.5 56.5,45.5 | 108.75,39.5 108.75,43 | v90.25,24.25 90.25,23.75 | v115.75,26 112.25,22.5 112.25,20 v110.75,18.5 | v133,19 134.25,20.25 134.25,21.25 | 134.25,21.25 v134.25,21.75 | v134.25,21.75 v134.25,26.5 | v134.25,21.75 134.25,21.25
  Bottom 0.305: v89.25,44.5 89.55,44.38 107.38,44.38 108.75,43 | 108.75,43 108.75,40.25 108.75,39.5 | 108.62,39.38 106.25,37 103.75,37 90.5,23.75 90.25,23.75 88,23.75 87.5,23.75 v81.25,23.75 | 108.62,39.38 108.75,39.5 | 108.62,39.38 108.75,39.5 | 108.75,39.5 108.75,43
  Bottom 0.61: v76.25,19 75.25,19 69.5,13.25 69.5,12.25 v68.12,10.88 68,10.75 40.75,10.75 38.5,10.75 37.75,11.5 31.75,11.5 30.75,10.5
  Bottom 0.813: v77.81,43.75 76.25,45.5 56.5,45.5 v56,45.5 46,45.5 44.5,44 44.5,40.54 LCD1.2 44.54,39.04 42.75,37.25 33.75,37.25 v32.62,38.38 32.5,38.25 32,38.25 26.5,38.25 25.25,37 v25.25,18.25 25.25,14.19 J2.2 28.94,10.5 30.75,10.5
A
  Top 0.254: J4.1 19.75,41.75 19.75,39.5 20.5,38.75 21.25,38.75 22.75,37.25 22.75,33.25 24.5,31.5 24.5,30 29.98,24.52 R9.2 31.26,24.38 U6.6
A0
  Top 0.254: 32.75,44.5 32.38,44.12 | 32.38,44.12 30.75,42.5 30.5,42.25 27.25,42.25 25,44.5 20.18,44.5 17,41.32 17,37.28 J4.10 | R15.2 32.5,44.25 32.38,44.12
A1
  Top 0.254: 30.52,35.25 J4.12 30.62,35.35 R10.1
AGND
  Top 0.178: U1.63 66.85,20 69.5,20 70.09,19.41 U11.63
  Top 0.254: U11.63 70.19,19.31 71.5,18 72.25,18 73,17.25 73,16.08 | 73,16.08 C13.2 | 73,16.08 74.02,16.08 R24.2
AREF
  Top 0.178: U1.62 66.64,19.5 69,19.5 69.63,18.87 U11.62
  Top 0.254: C13.1 71.51,16.96 U11.62
B
  Top 0.254: J4.2 23.45,37.43 23.45,33.3 25,31.75 25,30.25 29.75,25.5 31.5,25.5 32,25 35.13,25 35.32,24.81 35.32,23.23 35.21,23.12 U6.7 33.8,23.21 R9.1
BTNS  (via drill 0.6)
  Top 0.178: U1.61 66.43,19 68.5,19 69.06,18.44 U11.61
  Top 0.254: U11.61 73.17,14.17 | 73.17,14.17 74.09,13.25 C21.2 | v73.5,14.5 | v73.5,14.5 73.17,14.17 | v97.5,29 97.75,28.75 98,28.75 122.25,28.75 124.35,30.85 R25.2 124.35,32.1 124.5,32.25 124.75,32.5 126.25,32.5 127.25,31.5 133.5,31.5 135.25,29.75 135.25,26 133.5,24.25 J7.2
  Bottom 0.254: v73.5,14.5 73.55,14.45 73.55,13.8 74.05,13.29 75.05,13.29 83.5,21.75 84.75,23 90.75,23 96.75,29 v97.5,29
CAM_COM
  Top 0.254: J5.1 37.75,45.75 40.5,43 40.5,39 41,38.5 41,35.98 | 41,35.98 OK1.5 | OK1.7 38.5,35.77 38.5,34.25 39.25,33.5 | 41,35.98 42.17,35.98 CG5.1 43.1,35.65 43.72,35.03 43.72,33.97 43.25,33.5 39.25,33.5 | CG6.1 36.35,33.5 39.25,33.5
CAM_FOC
  Top 0.254: J5.4 37.6,38.75 39.25,38.75 39.9,38.1 OK1.6 39.75,35.49 39.75,34.75 40.15,34.35 CG5.2
CAM_SHT
  Top 0.254: OK1.8 35.85,35.89 35.5,36.25 | 35.5,36.25 34.75,37 34.75,39.95 J5.2 J5.3 | CG6.2 35.4,36.15 35.5,36.25
COM1  (via drill 0.6)
  Top 0.178: U1.14 62.75,26.89 62.75,29 62.75,29.22 U11.14
  Top 0.254: 38.5,20.5 44,20.5 46.02,22.52 46.02,23.48 v46,23.5 | 38.5,20.5 36.5,22.5 36.5,26.25 35.25,27.5 32.75,27.5 31.65,27.5 30.75,28.4 30.75,32 30.25,32.5 25,32.5 24,33.5 24,37.5 21.88,39.62 21.88,41.8 J4.3 | CG4.1 39.25,19.75 38.5,20.5 | v62.5,38.38 62.5,37.25 61.6,36.35 61.6,34.4 64.25,31.75 64.25,30.72 U11.14
  Bottom 0.254: v46,23.5 47.25,23.5 56.25,32.5 56.25,33.75 57,34.5 57.5,34.5 58,34 58.5,34 60.25,35.75 60.25,36.5 62,38.25 62.12,38.38 v62.5,38.38
COM2  (via drill 0.6)
  Top 0.178: U1.26 56.19,25 55.5,25 54.64,25.86 U11.26
  Top 0.254: U11.26 53.05,27.5 42.75,27.5 37,27.5 | 37,27.5 36.25,27.5 35.75,28 31.81,28 31.25,28.56 31.25,32.25 30.5,33 25.25,33 24.5,33.75 24.5,38.41 J4.4 | CG7.1 35.85,17.1 v36.5,17.75 | v37,27 37,27.5
  Bottom 0.254: v36.5,17.75 36.5,26.5 v37,27
COM3
  Top 0.178: U1.25 55.45,26.45 | 55.45,26.45 55.41,26.48 | U11.25 55.41,26.48 | 55.41,26.48 55.45,26.45
  Top 0.254: U11.25 53.68,28 42.75,28 36.5,28 36,28.5 32.5,28.5 32.25,28.5 32,28.5 31.75,28.75 31.75,32.5 31,33.25 | 31,33.25 30.75,33.5 25.5,33.5 25,34 25,38.1 J4.8 | CG1.2 31.5,32.75 31,33.25
CUR_SENSOR
  Top 0.178: U1.60 66.22,18.5 67.75,18.5 68.5,17.76 U11.60
  Top 0.254: U11.60 74.21,12 77,12 78,13 78,18 84,24 85.35,24 C20.2 R35.1
D+
  Top 0.406: J1.3 94.75,39.4 U10.1
D-
  Top 0.406: J1.2 95.4,39.25 U10.6
DE
  Top 0.178: U1.29 55.57,23.5 53.75,23.5 53.03,24.22 U11.29
  Top 0.254: U6.3 U6.2 39.13,23.15 R23.1 45.85,25.75 49,25.75 51.41,25.75 U11.29
FOC
  Top 0.178: U11.17 59.74,31.01 60.5,30.25 60.5,27.05 U1.17
  Top 0.254: 59.74,31.01 60,31.27 R13.1
GND  (via drill 0.6)
  Top 0.178: 58,26.02 58,27 56.9,28.1 U11.22 | U11.53 63.75,14.54 63.75,16 62.82,16.93 U1.53 61,18.77 61,19.25 61,23.02 U1.22
  Top 0.254: U1.22 58,26.02
  Top 0.61: 15.25,42.5 15.25,39.25 | 29,41 32.25,41
  Bottom 0.61: 15.25,42.5 15.25,39.25 | 31.5,39.25 31.5,42.5
  other vias: 27.75,31.5 27.75,30.25 27.75,29 41.5,22 58.5,21.25 63.5,21.25 61,18.75 61,23.75 80.5,42.75 88.25,35.5 27,36.75 29.5,36.75 39.25,7.25 39.25,8.5 40.75,7.25 40.75,8.5 42.25,7.25 42.25,8.5 43.75,7.25 43.75,8.5 45.25,7.25 45.25,8.5 46.75,7.25 46.75,8.5 48.25,7.25 48.25,8.5 49.75,7.25 49.75,8.5 50.5,35.25 47,32 106.5,43.25 103,43.25 69.12,9.88 76.12,17.12 80,33.5 151.5,4.25 153.25,4.25 149.75,4.25 153.25,8.25 151.5,8.25 149.75,8.25 77.5,23.75 120.5,22.75 103.5,13.25 125.75,13.25 146.5,13.25 19,12.25 19,13.75 19,15.25 19,16.75 12.75,18.5 14.25,18.5 15.75,18.5 17.25,18.5 12.75,10.5 14.25,10.5 15.75,10.5 17.25,10.5
  pour Top (isolate 0.254, rank 6): 0,47.25 0,0 154,0 154,47.25
  pour Bottom (rank 6): 0,47.25 0,0 154,0 154,47.25
IO_0
  Top 0.178: U1.18 60,26.85 60,29.5 59.16,30.34
  Top 0.254: J6.3 88.05,40.85 88.65,40.85 89.25,40.25 CG8.2 | J6.2 82.65,42.6 79.95,45.3 63.55,45.3 61,42.75 61,40 59,38 59,31.75 58.75,31.5 58.75,30.85 U11.18 59.16,30.34
  Bottom 0.254: J6.3 J6.2
IO_1
  Top 0.178: U1.19 59.5,26.64 59.5,29 58.62,29.88
  Top 0.254: CG9.2 84.8,39.15 J6.4 84.5,41.5 80.16,45.84 61.59,45.84 58.5,42.75 58.5,32 58,31.5 58,30.47 U11.19 58.62,29.88
IO_2  (via drill 0.6)
  Top 0.178: U1.1 69.89,21.66 U11.1
  Top 0.254: CG2.2 104.75,37.65 J3.4 | U11.1 74.02,22.52 v74.25,22.75
  Bottom 0.254: J3.4 92.15,26.25 74.75,26.25 74.25,25.75 v74.25,22.75
IO_3  (via drill 0.6)
  Top 0.178: 70.19,22.94 69.75,22.5 66.85,22.5 U1.2
  Top 0.254: J3.2 J3.3 106.6,37.5 CG3.2 | v72.25,23.75 70.85,23.75 U11.2 70.19,22.94
  Bottom 0.254: J3.2 103,40.75 103,37.75 92,26.75 73.25,26.75 72.25,25.75 v72.25,23.75
LCD_BK  (via drill 0.6)
  Top 0.178: U1.41 55.77,15.66 U11.41
  Top 0.254: R21.1 68,37.49 68,34.25 v68.12,34.25 | v55.5,13 55.25,13.25 55.25,15 55.5,15.25 55.5,15.18 U11.41
  Bottom 0.254: v68.12,34.25 67.25,34.25 50.93,17.93 50.93,17.57 v55.5,13
LCD_D4  (via drill 0.6)
  Top 0.178: U1.35 55.36,19.5 53.25,19.5 52.6,18.85 U11.35
  Top 0.254: v46.5,13 46.78,13.25 U11.35
  Bottom 0.254: LCD1.11 67.4,39.15 59.75,31.5 46.5,18.25 v46.5,13
LCD_D5  (via drill 0.6)
  Top 0.178: U1.36 55.57,19 53.75,19 53.03,18.28 U11.36
  Top 0.254: v48,13 48,13.34 U11.36
  Bottom 0.254: LCD1.12 69.5,40.5 65.25,36.25 47,18 47,14 47.5,13.5 v48,13
LCD_D6  (via drill 0.6)
  Top 0.178: U1.37 55.77,18.5 54.5,18.5 53.71,17.71 U11.37
  Top 0.254: v49.5,13 49.5,13.71 U11.37
  Bottom 0.254: LCD1.13 72.25,40.5 71,39.25 69,39.25 67.25,37.5 47.5,17.75 47.5,15 v49.5,13
LCD_D7  (via drill 0.6)
  Top 0.178: U1.38 55.98,18 55,18 54.15,17.15 U11.38
  Top 0.254: v51,13 51,14.08 U11.38
  Bottom 0.254: LCD1.14 74.25,40.5 72.5,38.75 69.5,38.75 48,17.25 48,16 v51,13
LCD_E  (via drill 0.6)
  Top 0.178: U1.39 55.94,17.25 55.5,17.25 54.83,16.58 U11.39
  Top 0.254: v52.5,13 52.5,14.45 U11.39
  Bottom 0.254: LCD1.6 55.95,41.75 75,41.75 75.25,41.75 75.5,41.75 76.22,41.03 76.22,39.97 75.5,39.25 73.75,39.25 72.75,38.25 69.75,38.25 48.85,17.35 48.85,16.65 v52.5,13
LCD_RS  (via drill 0.6)
  Top 0.178: U1.40 55.41,16.02 U11.40
  Top 0.254: v54,13 54,14.82 U11.40
  Bottom 0.254: LCD1.4 51.37,42.25 77.69,42.25 78.86,41.08 78.86,39.92 77.69,38.75 74,38.75 73,37.75 70,37.75 49.91,17.66 49.91,17.09 v54,13
LCDK
  Top 0.254: U2.6 78.29,32.25 80.5,32.25 82,33.75 82,38 82,38.6 LCD1.16
M0_A
  Top 0.178: U1.51 62.75,15.61 62.75,13.5 63.4,12.85 U11.51
  Top 0.254: U11.51 64.25,11.78 64.25,10.75 63.75,10.25 R7.2
M0_A1  (via drill 0.6)
  Top 0.254: R7.1 64.1,7.5 100,7.5 100.75,8.25 v100.75,8.5
  Bottom 0.254: v100.75,8.5 100.85,8.6 U5.10
M0_B
  Top 0.178: U1.50 62.25,15.4 62.25,12.75 62.84,12.16 U11.50
  Top 0.254: U11.50 63.5,11.4 63.5,11 62,9.5 R8.2
M0_B1  (via drill 0.6)
  Top 0.254: R8.1 62.85,7 101,7 102.25,8.25 v102.25,8.5
  Bottom 0.254: v102.25,8.5 101.5,9.25 U5.9
M0_O1
  Bottom 0.406: R27.1 106,15.35 106,15.5
  Bottom 1.27: MOT0.PWR 105.75,20.42 105.75,18.25
  pour Bottom (isolate 0.254): 104.75,21 104.75,9.5 106.75,9.5 106.75,21
M0_O2
  Bottom 0.406: R28.1 96.5,15.35 96.5,15.25
  Bottom 1.27: MOT0.GNDBREAK 116.44,38.81 | 116.44,38.81 103.88,26.25 99,26.25 96.75,24 96.75,18 | MOT0.GND 119.8,42.17 116.44,38.81
  pour Bottom (isolate 0.203): 95.5,21 95.5,9.5 97.75,9.5 97.75,21
M0_P
  Top 0.178: U1.49 61.75,15.2 61.75,12 62.26,11.49
  Top 0.254: R26.2 60.25,9.47 U11.49 62.26,11.49
M0_P1  (via drill 0.6)
  Top 0.254: R26.1 61.6,6.5 101.25,6.5 101.5,6.5 103.25,8.25 103.25,9 100.75,11.5 v100.75,17.75
  Bottom 0.254: v100.75,17.75 100.85,18.1 U5.27
M1_A
  Top 0.178: U1.48 60.59,12.36 U11.48
  Top 0.254: U11.48 58.75,10.52 R3.2
M1_B
  Top 0.178: 59.16,12.16 60,13 60,15.65 U1.47
  Top 0.254: R6.2 57.25,10.15 U11.47 59.16,12.16
M1_O1
  Bottom 0.406: R34.1 131.15,15.25 128.5,15.25
  Bottom 1.27: MOT1.PWR 127.5,29.17 127.5,17.5
  pour Bottom (isolate 0.254): 127,21 127,9.5 129,9.5 129,21
M1_O2
  Bottom 0.406: R33.1 115.6,15.25 118.5,15.25
  Bottom 1.27: 118.5,18.25 118.5,27.87 MOT1.GNDBREAK 132.8,42.17 MOT1.GND
  pour Bottom (isolate 0.203): 117.75,21 117.75,9.5 120,9.5 120,21
M1_P
  Top 0.178: U1.46 59.5,15.86 59.5,13.5 58.62,12.62 | 58.62,12.62 U11.46 58.62,12.62
  Top 0.254: U11.46 55.75,9.78 R32.2
M2_A
  Top 0.178: 58.19,13.19 59,14 59,16.07 U1.45
  Top 0.254: R1.2 54.25,10.5 54.75,11 55.84,11 U11.45 58.19,13.19
M2_B
  Top 0.178: 57.5,13.76 58.5,14.75 58.5,16.27 U1.44
  Top 0.254: R2.2 52.75,9.9 54.35,11.5 55.21,11.5 U11.44 57.5,13.76
M2_O1
  Bottom 0.406: R31.1 151.9,15.25 148.75,15.25
  Bottom 1.27: MOT2.PWR 146,34.67 146,25.5 149,22.5 149,18.5
  pour Bottom (isolate 0.254): 147.75,21 147.75,9.5 149.75,9.5 149.75,21
M2_O2
  Bottom 0.406: R30.1 136.35,15.25 140,15.25
  Bottom 1.27: 139.5,17.25 139.5,21.25 142.5,24.25 142.5,38.87 MOT2.GNDBREAK 145.8,42.17 MOT2.GND
  pour Bottom (isolate 0.203): 138.5,21 138.5,9.5 140.75,9.5 140.75,21
M2_P  (via drill 0.6)
  Top 0.178: U1.10 64.75,26.06 64.75,26.75 65.61,27.61
  Top 0.254: R29.2 51.75,9.65 v51.75,12 | v68.25,30.25 65.67,27.67 U11.10 65.61,27.61
  Bottom 0.254: v51.75,12 52.75,12 55.75,12 56.5,12.75 56.5,13.25 55.75,14 55.5,14 55.25,14 51.75,17.5 51.75,18 64,30.25 v68.25,30.25
MISO  (via drill 0.6)
  Top 0.178: U1.13 63.25,26.68 63.25,28.5 63.97,29.22 U11.13
  Top 0.254: v62.5,35.5 62.5,35 65.5,32 65.5,30.75 64.06,29.31 U11.13
  Bottom 0.254: J2.1 39.21,12.21 v62.5,35.5
MOSI  (via drill 0.6)
  Top 0.178: U1.12 63.75,26.48 63.75,28 64.5,28.75 U11.12
  Top 0.254: v63.5,36.5 63.5,34.75 66,32.25 66,30.25 64.54,28.79 U11.12
  Bottom 0.254: J2.4 28.48,13.5 30.25,13.5 31,12.75 39,12.75 61.25,35 61.25,35.75 62,36.5 v63.5,36.5
N$1
  Top 0.254: R35.2 87.15,22.7 U8.1
N$3
  Top 0.254: U12.4 13.52,23.83 R37.2 13.1,23.25 D1.ANODE
N$4  (via drill 0.6)
  Top 0.254: R3.1 60.6,6 101.75,6 103.25,7.5 122,7.5 v123,8.5 | v123,8.5
  Bottom 0.254: v123,8.5 123.1,8.6 U7.10
N$5
  Top 0.254: U2.2 79.25,34.5 79.5,34.75 79.5,38.88 78.88,39.5 78.88,44.13 78.2,44.8 74.56,44.8 71.25,41.5 71.25,39.45 R21.2
N$6  (via drill 0.6)
  Top 0.254: R6.1 59.6,5.5 102,5.5 103.5,7 123,7 v124.5,8.5
  Bottom 0.254: v124.5,8.5 123.75,9.25 U7.9
N$7  (via drill 0.6)
  Top 0.254: R32.1 58.6,5 102.25,5 103.75,6.5 123.5,6.5 123.75,6.5 125.5,8.25 125.5,9 123,11.5 v123,17.75
  Bottom 0.254: v123,17.75 123.1,17.85 U7.27
N$8  (via drill 0.6)
  Top 0.254: R29.1 55.6,3.5 103,3.5 104.5,5 124.5,5 126,6.5 144,6.5 145,7.5 145.75,7.5 146.25,8 146.25,9 143.75,11.5 v143.75,17.75
  Bottom 0.254: v143.75,17.75 143.85,18.1 U3.27
N$9  (via drill 0.6)
  Top 0.254: R2.1 56.6,4 102.75,4 104.25,5.5 124.25,5.5 125.75,7 143.75,7 v145.25,8.5
  Bottom 0.254: v145.25,8.5 144.5,9.25 U3.9
N$10  (via drill 0.6)
  Top 0.254: R1.1 57.6,4.5 102.5,4.5 104,6 124,6 125.5,7.5 127.25,7.5 142.75,7.5 v143.75,8.5
  Bottom 0.254: v143.75,8.5 143.85,8.6 U3.10
N$12  (via drill 0.6)
  Top 0.254: v93,40.25 94.12,41.38 94.12,43.25
  Bottom 0.254: 93,35 v93,40.25
N$21
  Top 0.254: LCD1.3 47.08,37.33 47,37.25 45.5,35.75 45.5,29.5 44.5,28.5 36.75,28.5 36.25,29 34,29 33.15,29.85 P1.WIPER
N$22  (via drill 0.6)
  Top 0.254: OK1.3 39.95,31.7 40.5,32.25 42.25,32.25 v43.75,30.75 | v60.62,38.25 60.62,37.27 R13.2
  Bottom 0.254: v43.75,30.75 51.5,38.5 60.25,38.5 60.5,38.25 v60.62,38.25
N$23  (via drill 0.6)
  Top 0.254: OK1.1 37.41,31.91 38.25,32.75 43.75,32.75 45,34 45,36 45.75,36.75 45.88,36.88 45.88,41.12 46.75,42 v47.75,43 | R16.2 72.85,38.35 73.75,39.25 73.75,42.5 v74.75,43.5
  Bottom 0.254: v74.75,43.5 48.25,43.5 v47.75,43
N$25
  Top 0.254: R14.2 73.75,34.5 U2.5
N$27
  Top 0.254: J7.6 128,29.25 R12.1 125.65,28.4 125.5,28.25 124.5,28.25 124.25,28 124.25,27.35 R18.2
N$28
  Top 0.254: J7.4 126.5,26.25 125.65,25.4 R17.1 125.65,24.4 125.5,24.25 124.5,24.25 124.25,24 124.25,23.35 R19.1
N$29
  Top 0.254: J7.5 R18.1 125.65,26.4 125.5,26.25 124.5,26.25 124.25,26 124.25,25.35 R17.2
N$30
  Top 0.254: R19.2 125.65,23.4 | J7.3 127,25.25 126.75,25 126.75,24.5 126.75,23.75 126.25,23.25 R19.2 | R19.2 R20.1
OK_SHT  (via drill 0.6)
  Top 0.254: U2.4 75.09,36.75 R16.1 74.25,36.75 76.25,38.75 v76.25,43.5 | v46,43 43.25,43 v42,44.25 | v35.5,43.75 33.75,42 33.75,38 32.75,37 R10.2
  Bottom 0.254: v76.25,43.5 76,43.5 75.25,44.25 75,44.5 74.5,44.5 74,44 47,44 v46,43 | v35.5,43.75 35.5,43 36.5,42 37,41.5 38.25,41.5 38.75,42 41,44.25 v42,44.25
PB6
  Top 0.178: U1.16 61.41,30.14 U11.16
PC7
  Top 0.178: U1.42 57.25,16.44 57.25,15.75 56.39,14.89 U11.42
PD5
  Top 0.178: U1.30 55.61,22.75 53.25,22.75 52.37,23.63 U11.30
  Top 0.254: 52.37,23.63 51.78,24.22 50.72,24.22 40,13.5 34.75,13.5 31.75,10.5 22.75,10.5 20.25,8 AUX_2.P$4
PD6
  Top 0.178: U11.31 52.65,22.25 55,22.25 55.4,22.25 U1.31
  Top 0.254: U11.31 51.4,23.5 51,23.5 50.75,23.5 40.25,13 35,13 32,10 23.5,10 21.52,8.02 AUX_2.P$5
PD7
  Top 0.178: U1.32 52.11,21.66 U11.32
  Top 0.254: U11.32 41.22,12.5 35.25,12.5 32.25,9.5 24.25,9.5 22.79,8.04 AUX_2.P$6
PE0
  Top 0.178: U1.33 54.95,20.5 51.75,20.5 51.24,19.99 U11.33
  Top 0.254: U11.33 43.27,12 35.5,12 32.5,9 25,9 24.06,8.06 AUX_2.P$7
PE1
  Top 0.178: U1.34 55.15,20 52.5,20 51.91,19.41 U11.34
  Top 0.254: U11.34 46.15,13.75 46,13.75 43.75,11.5 36.25,11.5 36,11.5 35.75,11.5 33.5,9.25 32.75,8.5 25.75,8.5 25.33,8.08 AUX_2.P$8
PE2
  Top 0.178: U1.43 58,16.48 58,15.25 57.07,14.32 U11.43
PE3  (via drill 0.6)
  Top 0.178: U1.9 66.23,26.84 U11.9
  Top 0.254: 66.12,26.88 67,27.75 67.25,27.75 70.5,31 72.25,31 72.5,30.75 76.75,30.75 85,30.75 v88.75,30.75 | 66.12,26.88 66,26.75 | 66.23,26.84 66.12,26.84 66.12,26.88 | CG10.2 92.65,34.5 v92.5,34.5
  Bottom 0.254: v88.75,30.75 v92.5,34.5 | v92.5,34.5 92.88,34.88 | 92.88,34.88 93,35 | v92.5,34.5 92.88,34.88
PF6
  Top 0.178: U1.55 65.25,15.94 65.25,15.5 65.67,15.08 U11.55
PF7
  Top 0.178: U1.54 63.19,17.31 64.5,16 64.5,14.92 U11.54
RD+
  Top 0.178: U1.5 66.22,24 67.75,24 68.5,24.75 U11.5
  Top 0.254: U10.3 93.8,36.45 95.75,34.5 95.75,31 91,26.25 69.96,26.25 U11.5
RD-
  Top 0.178: U1.4 66.43,23.5 68.25,23.5 68.97,24.22 U11.4
  Top 0.254: U11.4 70.59,25.75 91.25,25.75 96.2,30.7 U10.4
RST  (via drill 0.6)
  Top 0.178: U1.20 59,26.43 59,28.25 58.03,29.22 U11.20
  Top 0.254: U11.20 57.21,30.13 R11.2 57.25,31.83 v57.25,33.5
  Bottom 0.254: J2.5 33.06,14 38.5,14 57.25,32.75 v57.25,33.5
RX
  Top 0.178: U1.27 55.98,24.5 55,24.5 54.15,25.35 U11.27
  Top 0.254: U6.1 37.91,21.84 37.25,22.5 37.25,26 38.25,27 52.42,27 U11.27
SCK  (via drill 0.6)
  Top 0.178: U1.11 64.25,26.27 64.25,27.25 65.1,28.1 U11.11
  Top 0.254: v64.75,37.75 64.5,37.5 64.5,34.75 66.5,32.75 66.5,29.75 65.1,28.35 U11.11
  Bottom 0.254: J2.3 31.02,13.5 38.75,13.5 60.75,35.5 60.75,36.25 62,37.5 64.25,37.5 64.5,37.5 v64.75,37.75
SHT
  Top 0.178: 62.84,30.34 62.25,29.75 62.25,27.1 U1.15
  Top 0.254: 71.29,31.79 R14.1 71.03,31.78 68.72,31.78 66,34.5 66,37.75 64.45,39.3 62.24,39.3 61.5,38.56 61.5,37.25 61,36.75 61,34 63.5,31.5 63.5,31.1 U11.15 62.84,30.34
TEMP0_SENSOR
  Top 0.178: U1.56 66.23,15.66 U11.56
  Top 0.254: U11.56 71.68,10 77.5,10 79.5,8 97.5,8 99.5,10 U9.2
TEMP1_SENSOR
  Top 0.178: U1.57 66.59,16.02 U11.57
  Top 0.254: U11.57 72.32,10.5 77.5,10.5 77.75,10.5 79.75,8.5 97.25,8.5 97.75,9 97.75,17.5 99.75,19.5 115.75,19.5 121.2,14.05 U13.2
TEMP2_SENSOR
  Top 0.178: U1.58 65.81,17.5 66.5,17.5 67.36,16.64 U11.58
  Top 0.254: 67.36,16.64 73,11 77.5,11 78,11 80,9 96.5,9 97.25,9.75 97.25,17.75 99.5,20 116,20 135.5,20 136.55,20 U14.2
TX
  Top 0.178: U1.28 55.77,24 54.25,24 53.5,24.75 U11.28
  Top 0.254: U6.4 39.7,26.25 51.75,26.25 52.04,26.25 U11.28
UCAP
  Top 0.178: U1.7 66.06,25.25 66.75,25.25 67.36,25.86 U11.7
  Top 0.254: U11.7 69.99,28.54 C15.2
UGND  (1 unrouted)
  Top 0.178: U1.6 66.02,24.5 67.25,24.5 67.93,25.18 U11.6
  Top 0.254: U11.6 69.58,27 71,27 72,28 | 72,28 72,28.75 71.29,29.46 C15.1 | J1.S3 97.95,45.95 98,46 | J1.5 J1.S4 91.45,43.35 | 91.55,38.2 91.55,32 | 91.55,32 91.55,29.05 89.25,26.75 73.25,26.75 72,28 | 93.65,32 91.55,32
  Top 0.406: 98.1,43.4 J1.S3 97.95,41.45 R22.1 | J1.S4 91.55,38.2 91.75,38 92.25,37.5 U10.2
  Top 0.813: J1.S3 97.95,45.83 J1.S1 J1.S2 91.55,45.83
VIN  (via drill 0.6)
  Top 0.254: v90.75,10.25 90.75,15.5 | 90.75,15.5 90.75,16 90.75,19.3 U8.3 | R5.2 90.25,16 90.75,15.5
  Top 0.305: C8.1 4.31,16.79 U4.1
  Top 1.016: v6,22.5 6.35,22.5 C17.A 6.35,17.69 U4.1
  Bottom 0.305: v90.75,10.25 89.6,9.1 R36.1
  Bottom 0.406: R36.1 90.25,4.9
  other vias: 9.75,29.5 11,29.5 12.25,29.5 9.75,27.5 11,27.5 12.25,27.5 8.5,29.5 8.5,27.5 7.25,27.5 6,27.5 6,26.25 6,25 6,23.75 7.25,26.25 7.25,25 7.25,28.75 7.25,30 6,31.25 4.75,27 4.75,25.75 4.75,24.5 4.75,23.25
  pour Bottom (no thermals): 90.5,5.5 90.5,3 13.5,3 7.5,9 7.5,19.75 4,23.25 4,27.5 5.5,29.5 5.5,33.5 8.75,30.25 13,30.25 13,25 11.5,25 11.5,10 16,5.5
  pour Top (no thermals): 15.25,25 12,25 12,21.75 5.5,21.75 5.5,21.75 4,23.25 4,27.5 5.5,29 5.5,33.5 8.75,30.25 12.95,30.25 15.25,27.95
VIN_J
  pour Top (no thermals): 14,30.75 9,30.75 5.5,34.25 5.5,37.25 7,38.75 11.75,38.75 14.25,36.5 14.25,31
VIN_M  (via drill 0.6, 0.9)
  Top 0.254: v93.75,10.25 93.75,19.3 U8.4
  Top 1.27: v142.25,4 145.75,4 146.9,5.15 C12.POS
  Bottom 0.305: U7.14 U7.13 | U7.13 121.6,10.39 | 121.6,10.39 U7.12 | U7.12 U7.11 U7.12 | U7.12 121.6,10.39 | 121.6,10.39 U7.13 | U7.29 U7.30 | U7.30 U7.31 | U7.31 U7.32 | U7.31 U7.30 | U5.14 U5.13 | U5.13 99,10.39 | 99,10.39 U5.12 | U5.12 U5.11 | U5.13 99,10.39 | U5.12 U5.13 | U5.29 U5.30 U5.31 U5.32 | U3.32 U3.31 U3.30 U3.29 146.13,20.12 146.25,20 | U3.14 U3.13 | U3.13 U3.12 | U3.12 U3.11 U3.12 | U3.12 U3.13 | v93.75,10.25 92.4,8.9 R36.2
  Bottom 0.406: U5.14 98.36,10.5 100,10.5 | U7.11 122.34,10.5 120.5,10.5
  Bottom 1.27: U5.12 99.22,10.06 C11.2 | C11.2 99.25,6.9 99.25,13.5 103,17.25 103,20.12 U5.31 | U7.31 125.25,19.66 125.25,17 121.8,13.55 U7.12 121.6,10.39 121.5,10.39 121.5,4.25 121.5,6.9 C10.2 | U3.31 146,19.66 146,16.5 142.55,13.05 U3.12 142.35,10.18 C9.2 142.35,5.1 141.75,4.5 141.75,4.25 142,4 v142.25,4 | C11.2 99.22,4.27 99.25,4.25
  pour Bottom (no thermals): 143,5.25 91.5,5.5 91.5,3 143,2.75
VOL_SENSOR
  Top 0.178: U1.59 66.02,18 67,18 67.85,17.15 U11.59
  Top 0.254: R5.1 R4.2 | C14.1 R4.2 | R4.2 83,17.25 77.25,11.5 73.58,11.5 U11.59
X1
  Top 0.178: U1.24 55.77,26.84 U11.24
  Top 0.254: U11.24 53.77,29.04 50.25,29.04 | 50.25,29.04 C4.2 | X1.3 49.1,30.19 50.25,29.04
X2
  Top 0.178: U1.23 57.5,25.81 57.5,26.25 56.33,27.42 U11.23
  Top 0.254: C3.2 52.05,32.38 X1.1 56.14,27.61 U11.23

### Text on the board
tPlace: Dynamic Perception LLC | (c) Copyright 2013 | dynamicperception.com | Super Dolly Board REV 4
tNames: LCD1 | U2